# EAGLE design grapefruit-board (EAGLE 7.4.0)
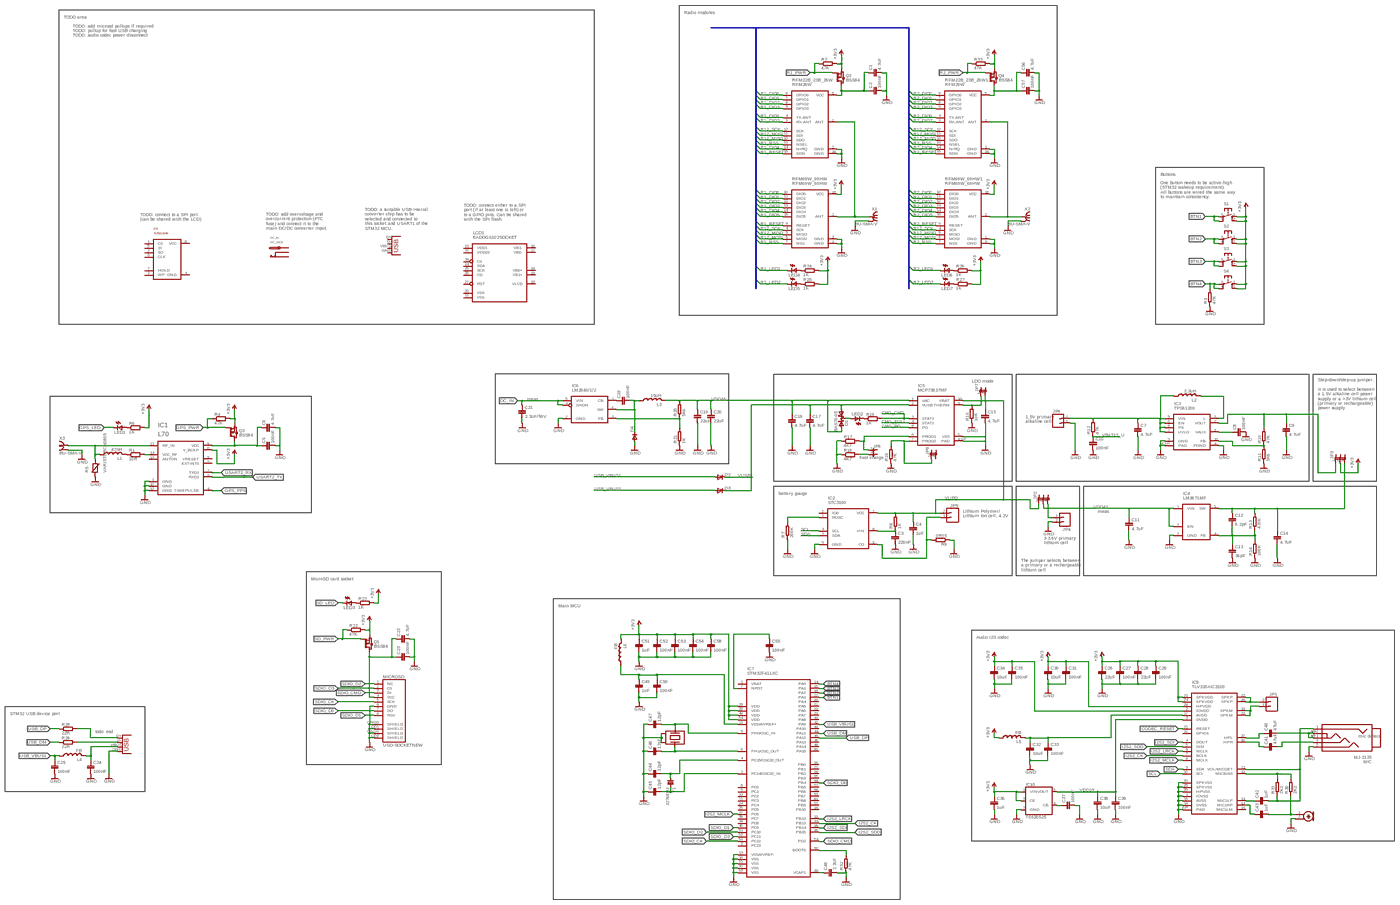
[diagram p0: schematic, sheet 1, overview]
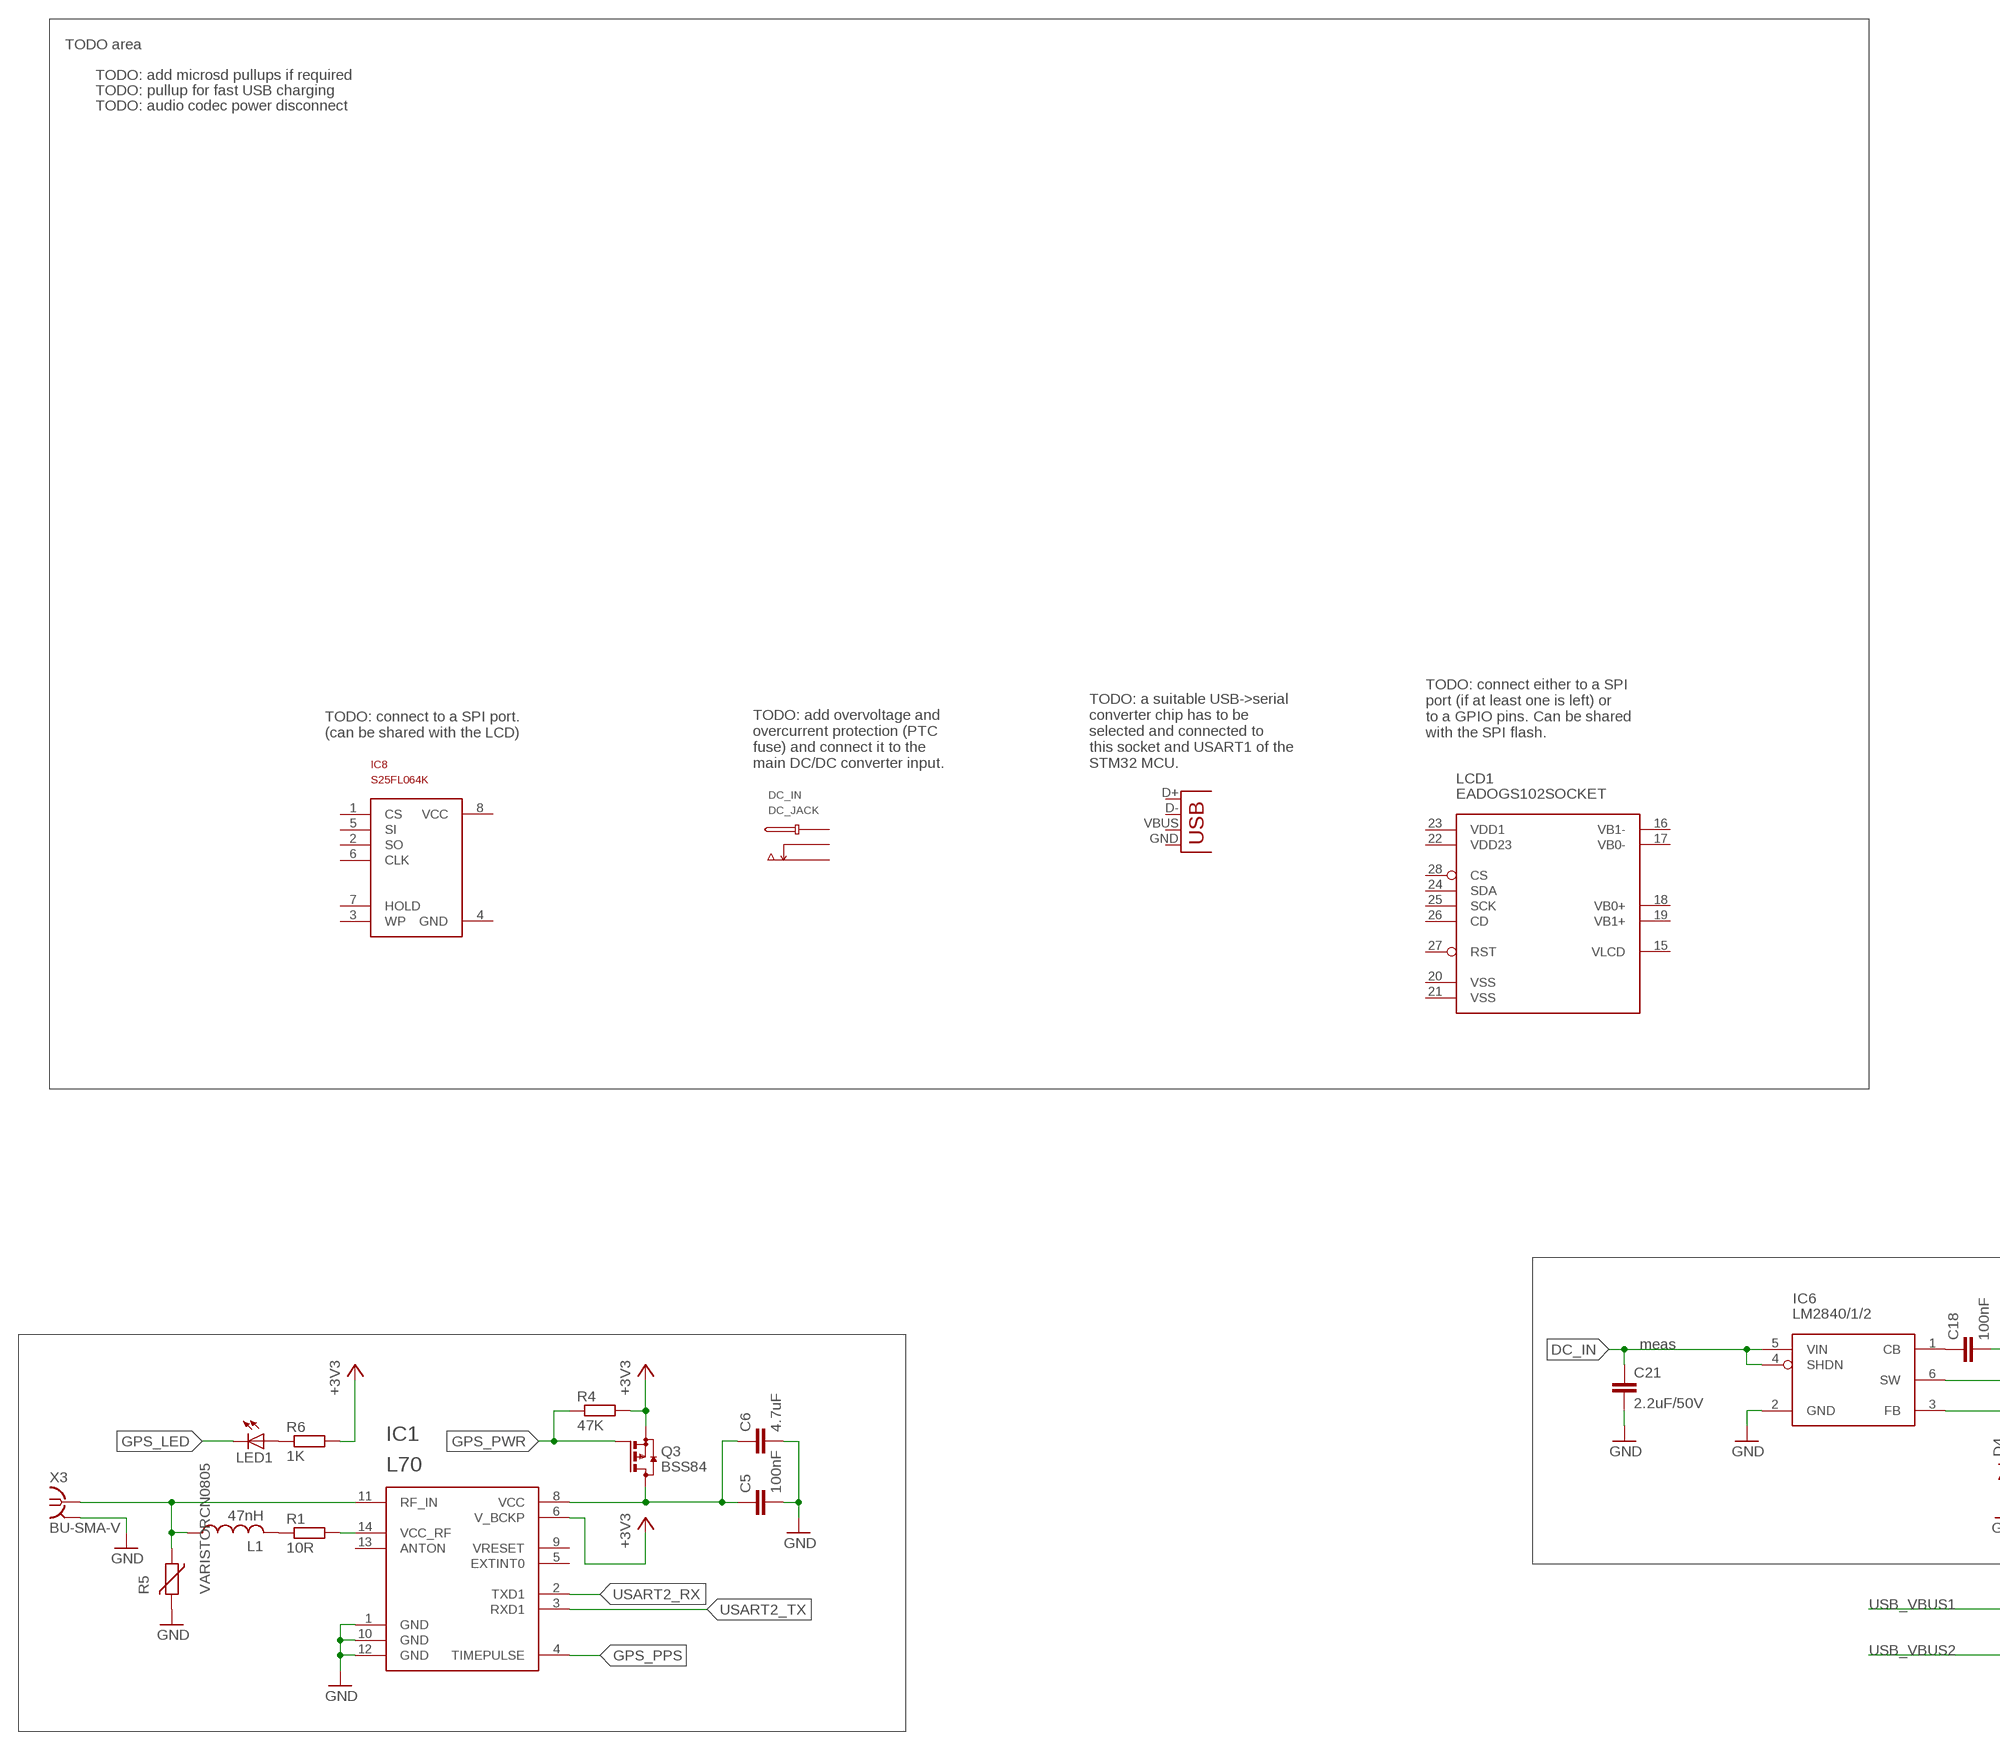
[diagram p1: schematic, sheet 1, part 1 of 4]
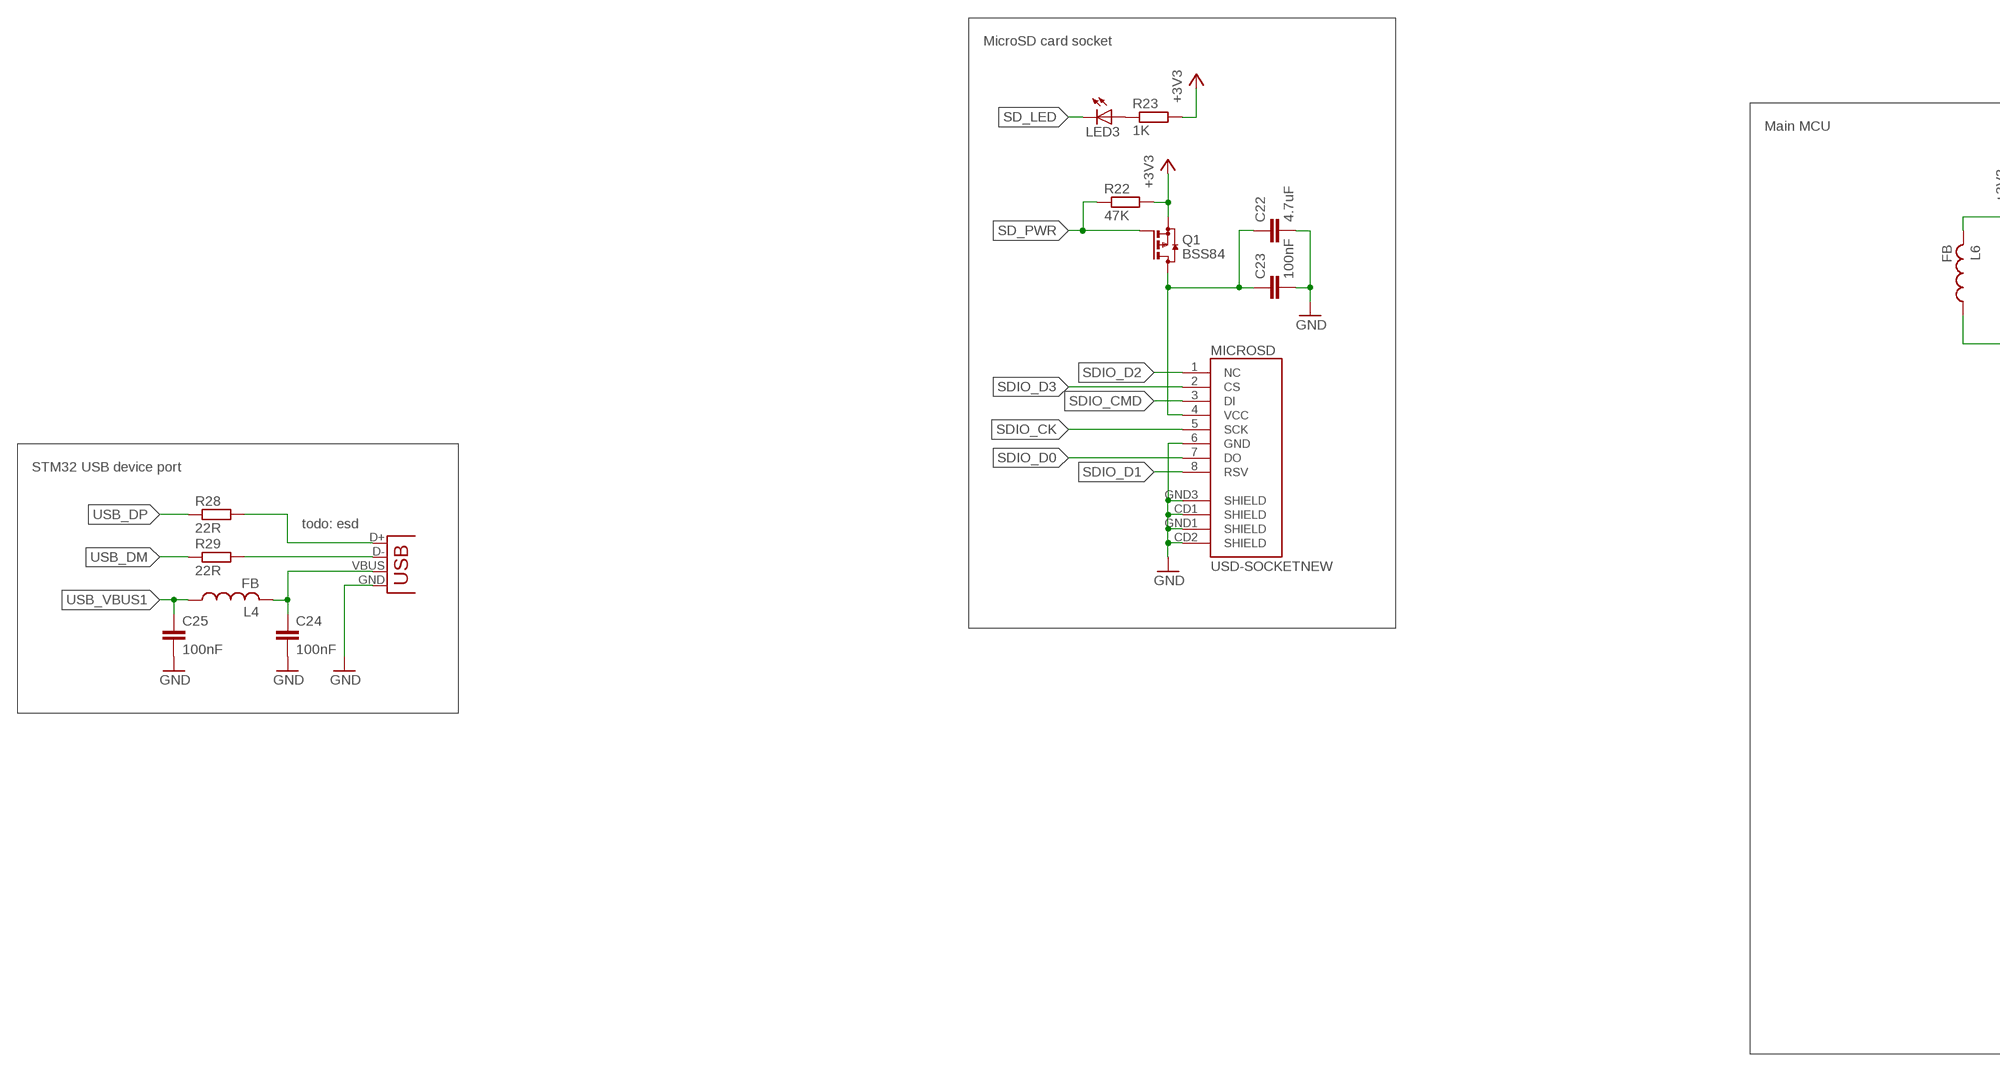
[diagram p2: schematic, sheet 1, part 2 of 4]
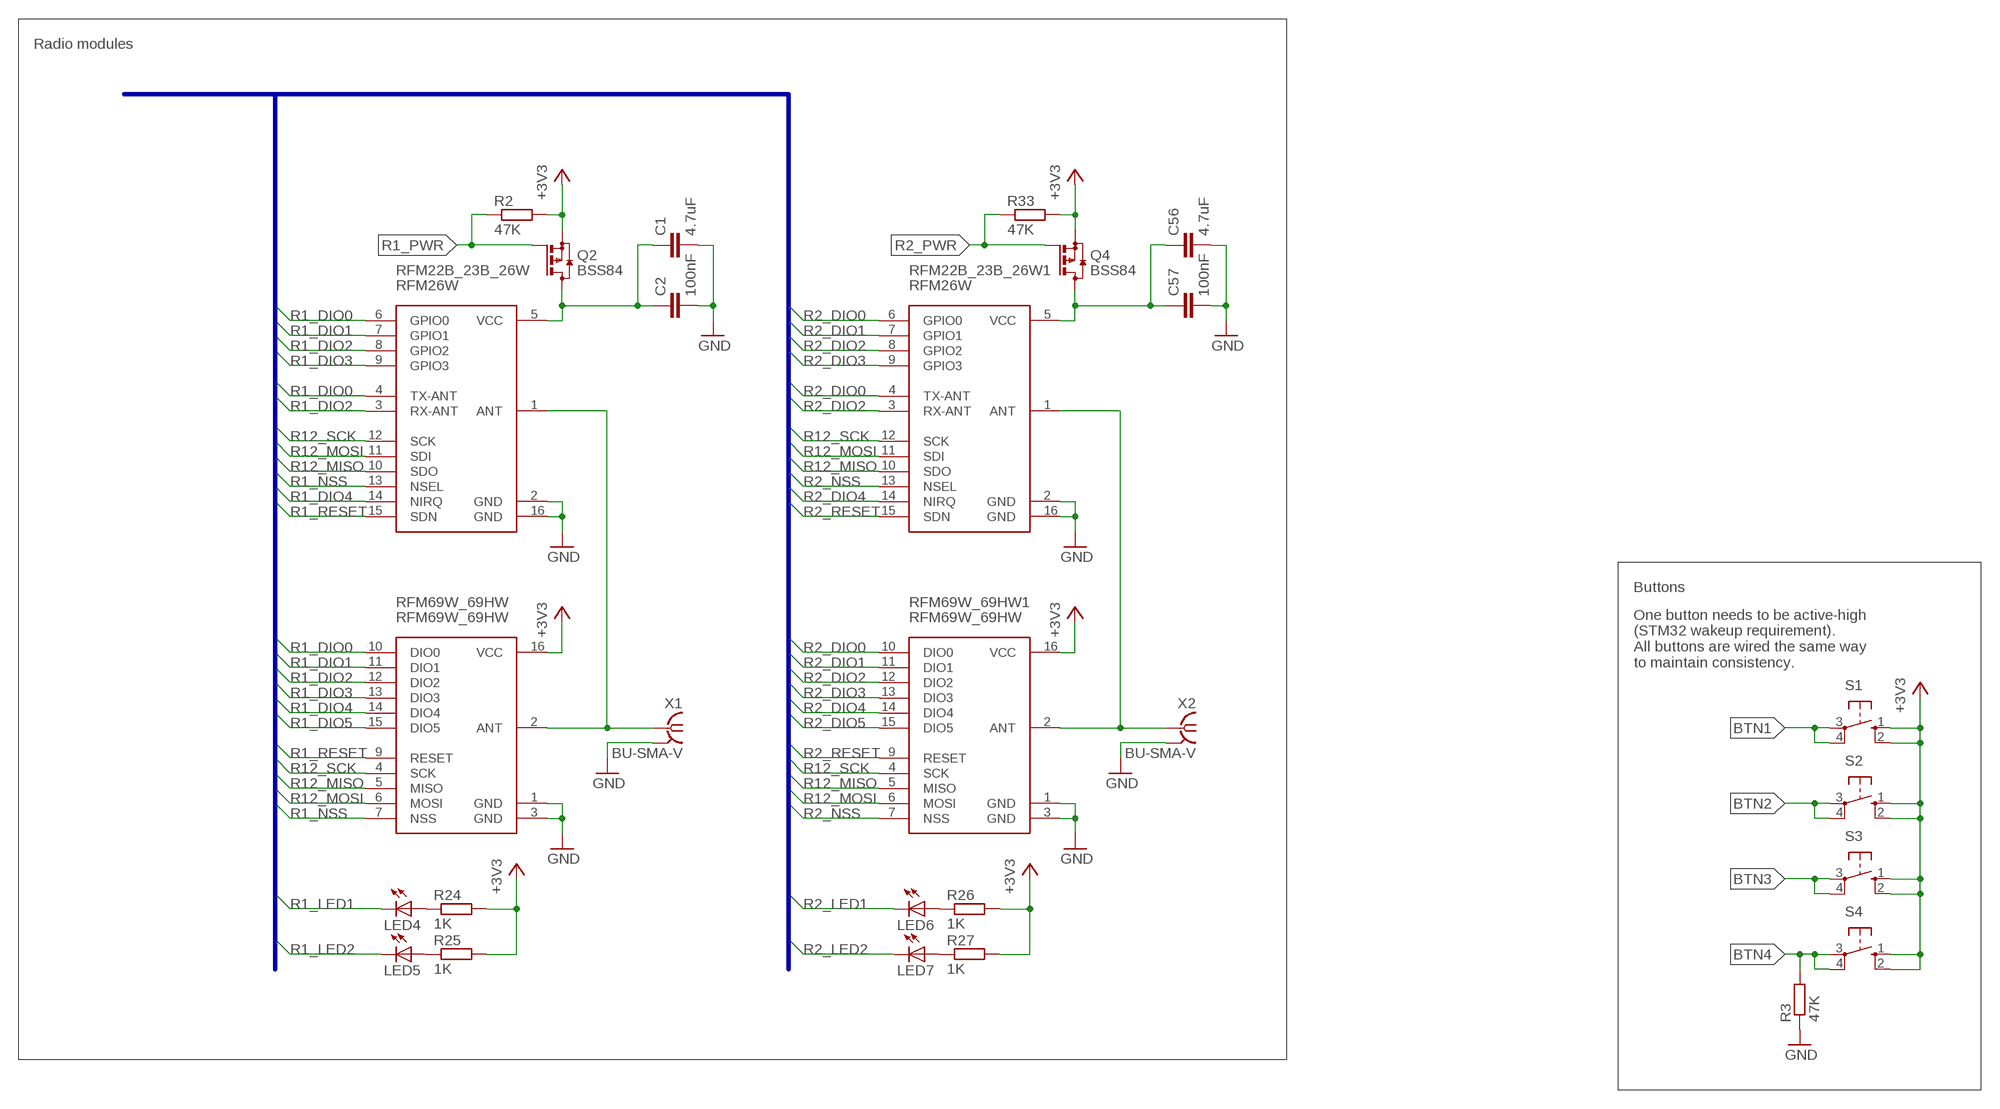
[diagram p3: schematic, sheet 1, part 3 of 4]
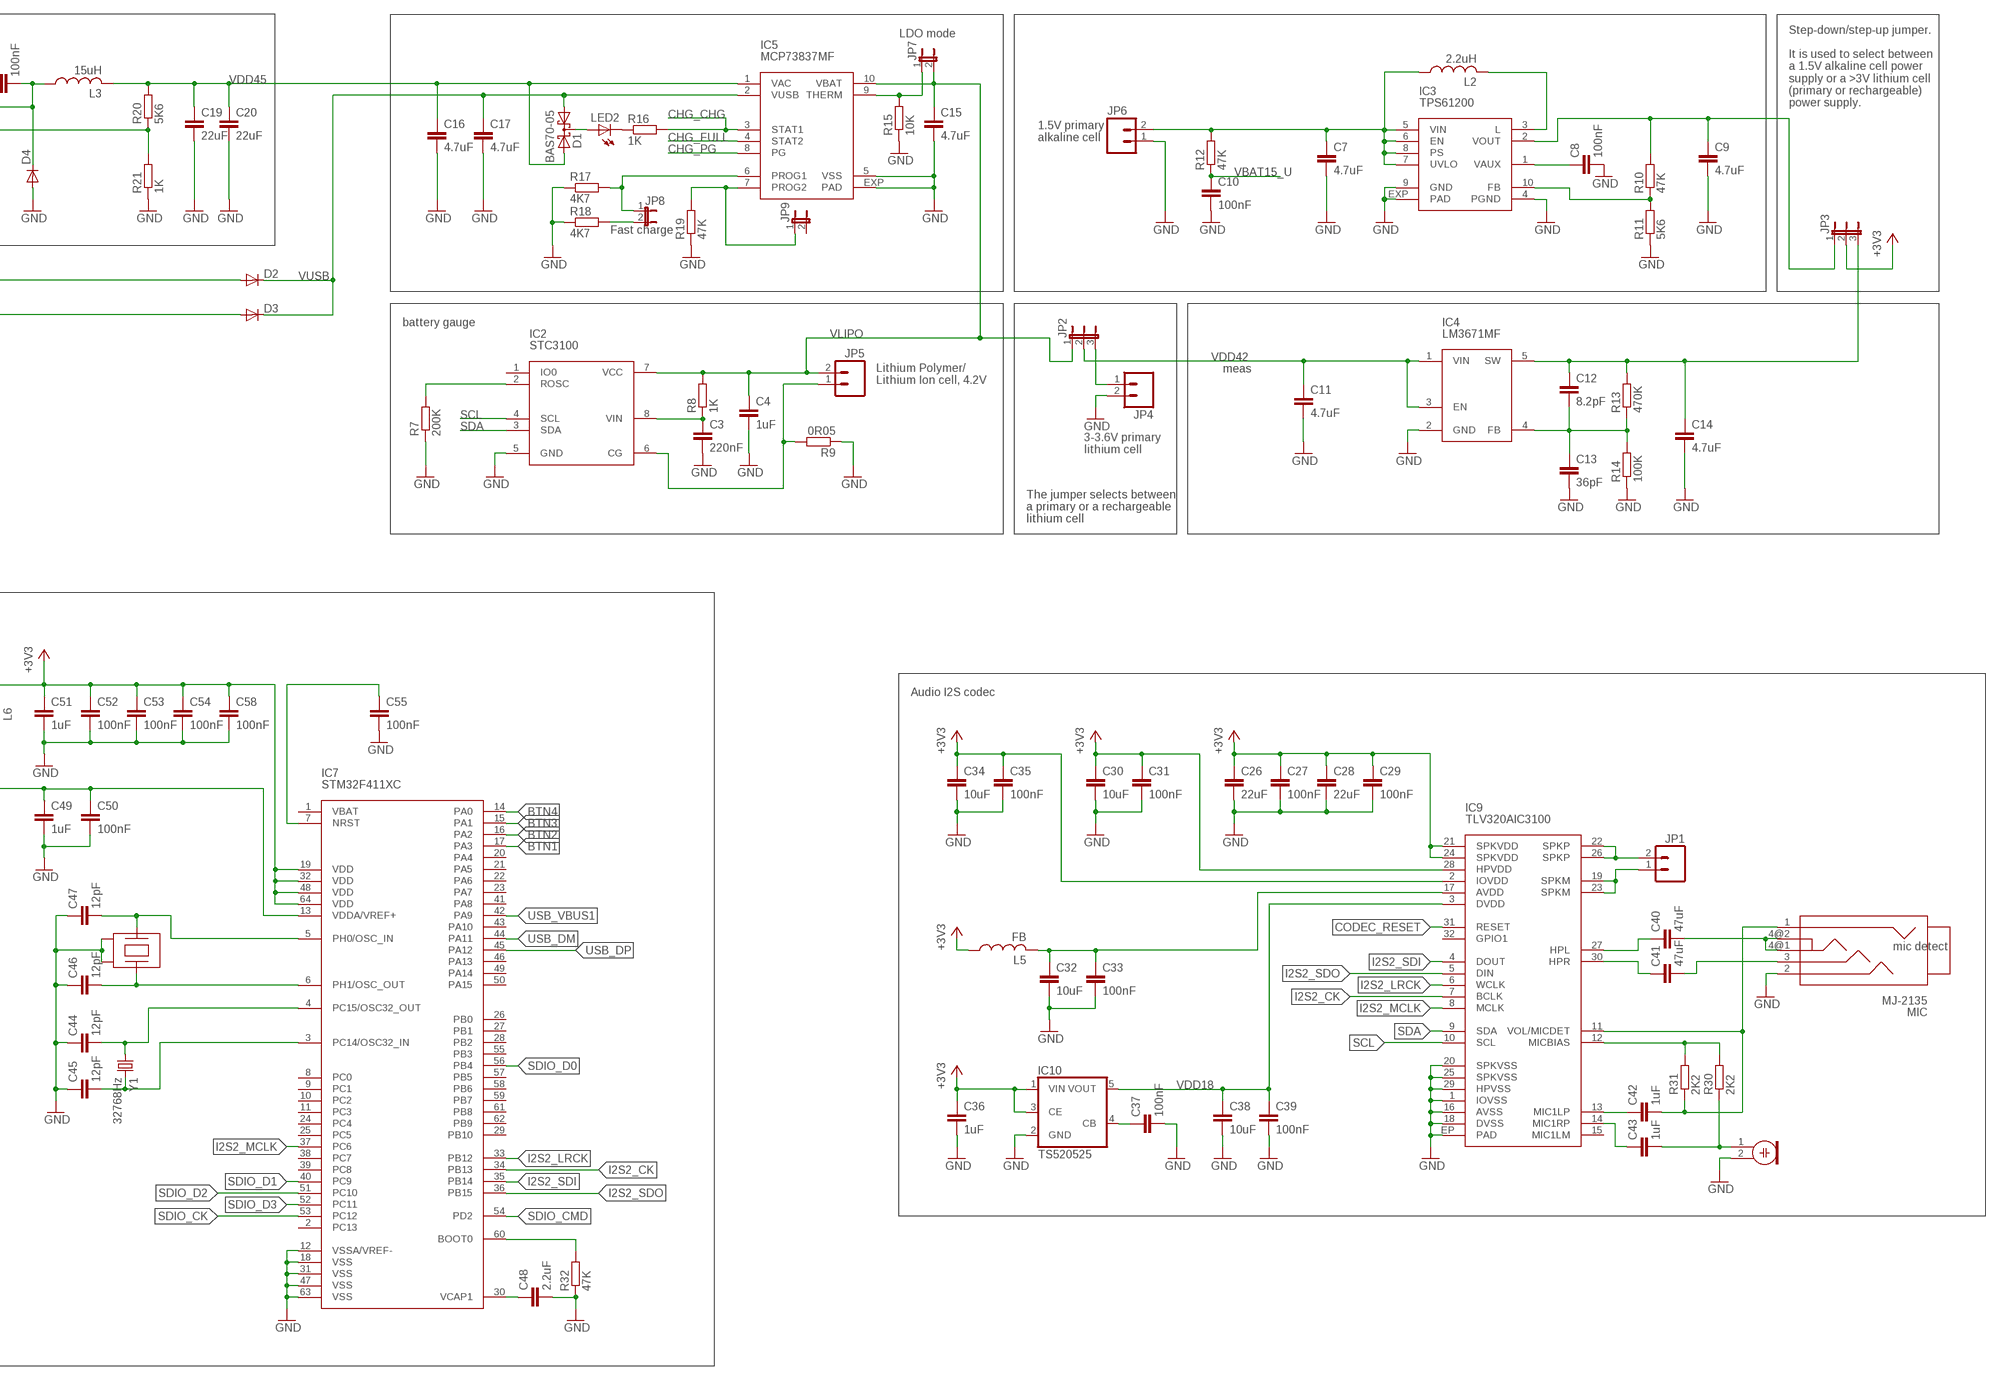
[diagram p4: schematic, sheet 1, part 4 of 4]

## Parts
C1  4.7uF  C-EUC0805  [C0805]
C2  100nF  C-EUC0603  [C0603]
C3  220nF  C-EUC0603  [C0603]
C4  1uF  C-EUC0603  [C0603]
C5  100nF  C-EUC0603  [C0603]
C6  4.7uF  C-EUC0805  [C0805]
C7  4.7uF  C-EUC0805  [C0805]
C8  100nF  C-EUC0603  [C0603]
C9  4.7uF  C-EUC0805  [C0805]
C10  100nF  C-EUC0603  [C0603]
C11  4.7uF  C-EUC0805  [C0805]
C12  8.2pF  C-EUC0603  [C0603]
C13  36pF  C-EUC0603  [C0603]
C14  4.7uF  C-EUC0805  [C0805]
C15  4.7uF  C-EUC0805  [C0805]
C16  4.7uF  C-EUC0805  [C0805]
C17  4.7uF  C-EUC0805  [C0805]
C18  100nF  C-EUC0603  [C0603]
C19  22uF  C-EUC1206  [C1206]
C20  22uF  C-EUC1206  [C1206]
C21  2.2uF/50V  C-EUC1206  [C1206]
C22  4.7uF  C-EUC0805  [C0805]
C23  100nF  C-EUC0603  [C0603]
C24  100nF  C-EUC0603  [C0603]
C25  100nF  C-EUC0603  [C0603]
C26  22uF  C-EUC1206  [C1206]
C27  100nF  C-EUC0603  [C0603]
C28  22uF  C-EUC1206  [C1206]
C29  100nF  C-EUC0603  [C0603]
C30  10uF  C-EUC1206  [C1206]
C31  100nF  C-EUC0603  [C0603]
C32  10uF  C-EUC1206  [C1206]
C33  100nF  C-EUC0603  [C0603]
C34  10uF  C-EUC1206  [C1206]
C35  100nF  C-EUC0603  [C0603]
C36  1uF  C-EUC0805  [C0805]
C37  100nF  C-EUC0603  [C0603]
C38  10uF  C-EUC1206  [C1206]
C39  100nF  C-EUC0603  [C0603]
C40  47uF  C-EUC1206  [C1206]
C41  47uF  C-EUC1206  [C1206]
C42  1uF  C-EUC0603  [C0603]
C43  1uF  C-EUC0603  [C0603]
C44  12pF  C-EUC0603  [C0603]
C45  12pF  C-EUC0603  [C0603]
C46  12pF  C-EUC0603  [C0603]
C47  12pF  C-EUC0603  [C0603]
C48  2.2uF  C-EUC0805  [C0805]
C49  1uF  C-EUC0603  [C0603]
C50  100nF  C-EUC0603  [C0603]
C51  1uF  C-EUC0603  [C0603]
C52  100nF  C-EUC0603  [C0603]
C53  100nF  C-EUC0603  [C0603]
C54  100nF  C-EUC0603  [C0603]
C55  100nF  C-EUC0603  [C0603]
C56  4.7uF  C-EUC0805  [C0805]
C57  100nF  C-EUC0603  [C0603]
C58  100nF  C-EUC0603  [C0603]
D1  BAS70-05  [SOT23]
D2  DIODE-MICROMELF-W  [MICROMELF-W]
D3  DIODE-MICROMELF-W  [MICROMELF-W]
D4  DIODE-MICROMELF-W  [MICROMELF-W]
DC_IN  DC_JACK  [DC_JACK]
IC1  L70  [L70]
IC2  STC3100  [MSOP8]
IC3  TPS61200  [DFN10-3X3]
IC4  LM3671MF  [SOT23-5]
IC5  MCP73837MF  [DFN10-3X3]
IC6  LM2840/1/2  [SOT23-6]
IC7  STM32F411XC  [LQFP64]
IC8  S25FL064K  [SO-08M]
IC9  TLV320AIC3100  [QFN32]
IC10  TS520525  [SOT25]
JP1  M02JST-PTH-2  [JST-2-PTH]
JP2  JP2E  [JP2]
JP3  JP2E  [JP2]
JP4  M02JST-PTH-2  [JST-2-PTH]
JP5  M02JST-PTH-2  [JST-2-PTH]
JP6  M02JST-PTH-2  [JST-2-PTH]
JP7  JP1E  [JP1]
JP8  JP1E  [JP1]
JP9  JP1E  [JP1]
L1  47nH  L-USL2012C  [L2012C]
L2  2.2uH  L-USL2012C  [L2012C]
L3  15uH  L-USL3225M  [L3225M]
L4  FB  L-USL2012C  [L2012C]
L5  FB  L-USL2012C  [L2012C]
L6  FB  L-USL2012C  [L2012C]
LCD1  EADOGS102SOCKET  [EADOGS-SOCKET]
LED1  LEDCHIP-LED0603  [CHIP-LED0603]
LED2  LEDCHIP-LED0603  [CHIP-LED0603]
LED3  LEDCHIP-LED0603  [CHIP-LED0603]
LED4  LEDCHIP-LED0603  [CHIP-LED0603]
LED5  LEDCHIP-LED0603  [CHIP-LED0603]
LED6  LEDCHIP-LED0603  [CHIP-LED0603]
LED7  LEDCHIP-LED0603  [CHIP-LED0603]
M1  ELECTRET_MICROPHON-WM-62PC/62PK  [WM-62PC/62PK]
MIC  MJ-2135  [JACK_35_4POLE]
MICROSD  USD-SOCKETNEW  [MICRO-SD-SOCKET-PP]
Q1  BSS84  [SOT23]
Q2  BSS84  [SOT23]
Q3  BSS84  [SOT23]
Q4  BSS84  [SOT23]
R1  10R  R-EU_R0603  [R0603]
R2  47K  R-EU_R0603  [R0603]
R3  47K  R-EU_R0603  [R0603]
R4  47K  R-EU_R0603  [R0603]
R5  VARISTORCN0805  [CT/CN0805]
R6  1K  R-EU_R0603  [R0603]
R7  200K  R-EU_R0603  [R0603]
R8  1K  R-EU_R0603  [R0603]
R9  0R05  R-EU_R0805  [R0805]
R10  47K  R-EU_R0603  [R0603]
R11  5K6  R-EU_R0603  [R0603]
R12  47K  R-EU_R0603  [R0603]
R13  470K  R-EU_R0603  [R0603]
R14  100K  R-EU_R0603  [R0603]
R15  10K  R-EU_R0603  [R0603]
R16  1K  R-EU_R0603  [R0603]
R17  4K7  R-EU_R0603  [R0603]
R18  4K7  R-EU_R0603  [R0603]
R19  47K  R-EU_R0603  [R0603]
R20  5K6  R-EU_R0603  [R0603]
R21  1K  R-EU_R0603  [R0603]
R22  47K  R-EU_R0603  [R0603]
R23  1K  R-EU_R0603  [R0603]
R24  1K  R-EU_R0603  [R0603]
R25  1K  R-EU_R0603  [R0603]
R26  1K  R-EU_R0603  [R0603]
R27  1K  R-EU_R0603  [R0603]
R28  22R  R-EU_R0603  [R0603]
R29  22R  R-EU_R0603  [R0603]
R30  2K2  R-EU_R0603  [R0603]
R31  2K2  R-EU_R0603  [R0603]
R32  47K  R-EU_R0603  [R0603]
R33  47K  R-EU_R0603  [R0603]
RFM22B_23B_26W  RFM26W  [MODULE_16X16_16PIN]
RFM22B_23B_26W1  RFM26W  [MODULE_16X16_16PIN]
RFM69W_69HW  RFM69W_69HW  [MODULE_20X12_16PIN]
RFM69W_69HW1  RFM69W_69HW  [MODULE_20X12_16PIN]
S1  10-XX  [B3F-10XX]
S2  10-XX  [B3F-10XX]
S3  10-XX  [B3F-10XX]
S4  10-XX  [B3F-10XX]
U$1  XTAL-7M  [XTAL_7M]
X1  BU-SMA-V  [BU-SMA-V]
X2  BU-SMA-V  [BU-SMA-V]
X3  BU-SMA-V  [BU-SMA-V]
X4  USB-MICROB  [USB-MICROB]
X5  USB-MICROB  [USB-MICROB]
Y1  32768Hz  CRYSTALTC26H  [TC26H]

## Nets
+3V3: C26.1 C27.1 C28.1 C29.1 C30.1 C31.1 C34.1 C35.1 C36.1 C51.1 C52.1 C53.1 C54.1 C58.1 IC1.6(V_BCKP) IC7.19(VDD) IC7.32(VDD) IC7.48(VDD) IC7.64(VDD) IC9.2(IOVDD) IC9.21(SPKVDD) IC9.24(SPKVDD) IC9.28(HPVDD) IC10.1(VIN) IC10.3(CE) JP3.2 L5.1 L6.2 Q1.2(S) Q2.2(S) Q3.2(S) Q4.2(S) R2.2 R4.2 R6.2 R22.2 R23.2 R24.2 R25.2 R26.2 R27.2 R33.2 RFM69W_69HW1.16(VCC) RFM69W_69HW.16(VCC) S1.1(S) S1.2(S1) S2.1(S) S2.2(S1) S3.1(S) S3.2(S1) S4.1(S) S4.2(S1)
BTN1: IC7.17(PA3) S1.3(P) S1.4(P1)
BTN2: IC7.16(PA2) S2.3(P) S2.4(P1)
BTN3: IC7.15(PA1) S3.3(P) S3.4(P1)
BTN4: IC7.14(PA0) R3.2 S4.3(P) S4.4(P1)
CHG_CHG: IC5.3(STAT1) R16.2
CHG_FULL: IC5.4(STAT2)
CHG_PG: IC5.8(PG)
CODEC_RESET: IC9.31(RESET)
DC_IN: C21.1 IC6.4(SHDN) IC6.5(VIN)
GND: C1.2 C2.2 C3.2 C4.2 C5.2 C6.2 C7.2 C8.2 C9.2 C10.2 C11.2 C13.2 C14.2 C15.2 C16.2 C17.2 C19.2 C20.2 C21.2 C22.2 C23.2 C24.2 C25.2 C26.2 C27.2 C28.2 C29.2 C30.2 C31.2 C32.2 C33.2 C34.2 C35.2 C36.2 C37.2 C38.2 C39.2 C44.1 C45.1 C46.1 C47.1 C48.2 C49.2 C50.2 C51.2 C52.2 C53.2 C54.2 C55.2 C56.2 C57.2 C58.2 D4.A IC1.1(GND) IC1.10(GND) IC1.12(GND) IC2.5(GND) IC3.4(PGND) IC3.9(GND) IC3.EXP(PAD) IC4.2(GND) IC5.5(VSS) IC5.EXP(PAD) IC6.2(GND) IC7.12(VSSA/VREF-) IC7.18(VSS) IC7.31(VSS) IC7.47(VSS) IC7.63(VSS) IC9.1(IOVSS) IC9.16(AVSS) IC9.18(DVSS) IC9.20(SPKVSS) IC9.25(SPKVSS) IC9.29(HPVSS) IC9.EP(PAD) IC10.2(GND) JP4.2 JP6.1 M1.2 MIC.2 MICROSD.6(GND) MICROSD.CD1(SHIELD) MICROSD.CD2(SHIELD) MICROSD.GND1(SHIELD) MICROSD.GND3(SHIELD) R3.1 R5.2 R7.1 R9.1 R11.1 R14.1 R15.1 R17.1 R18.1 R19.1 R21.1 R32.1 RFM22B_23B_26W1.2(GND) RFM22B_23B_26W1.16(GND) RFM22B_23B_26W.2(GND) RFM22B_23B_26W.16(GND) RFM69W_69HW1.1(GND) RFM69W_69HW1.3(GND) RFM69W_69HW.1(GND) RFM69W_69HW.3(GND) U$1.2(G1) U$1.4(G2) X1.2 X1.3 X1.4 X1.5 X2.2 X2.3 X2.4 X2.5 X3.2 X3.3 X3.4 X3.5 X4.GND
GPS_LED: LED1.C
GPS_PPS: IC1.4(TIMEPULSE)
GPS_PWR: Q3.1(G) R4.1
I2S2_CK: IC7.34(PB13) IC9.7(BCLK)
I2S2_LRCK: IC7.33(PB12) IC9.6(WCLK)
I2S2_MCLK: IC7.37(PC6) IC9.8(MCLK)
I2S2_SDI: IC7.35(PB14) IC9.4(DOUT)
I2S2_SDO: IC7.36(PB15) IC9.5(DIN)
N$1: RFM22B_23B_26W1.1(ANT) RFM69W_69HW1.2(ANT) X2.1
N$2: RFM22B_23B_26W.1(ANT) RFM69W_69HW.2(ANT) X1.1
N$3: L1.2 R1.1
N$4: IC1.11(RF_IN) L1.1 R5.1 X3.1
N$5: IC1.14(VCC_RF) R1.2
N$6: C1.1 C2.1 Q2.3(D) RFM22B_23B_26W.5(VCC)
N$7: LED1.A R6.1
N$8: C5.1 C6.1 IC1.8(VCC) Q3.3(D)
N$9: C7.1 IC3.5(VIN) IC3.6(EN) IC3.7(UVLO) IC3.8(PS) JP6.2 L2.1 R12.2
N$10: JP2.3 JP4.1
N$11: IC2.6(CG) JP5.1 R9.2
N$12: IC5.9(THERM) JP7.1 R15.2
N$13: IC5.6(PROG1) JP8.1 R17.2
N$14: C12.1 C14.1 IC4.5(SW) JP3.3 R13.2
N$15: C3.1 IC2.8(VIN) R8.1
N$16: C8.1 IC3.1(VAUX)
N$17: IC2.2(ROSC) R7.2
N$18: C9.1 IC3.2(VOUT) JP3.1 R10.2
N$19: IC3.3(L) L2.2
N$20: C12.2 C13.1 IC4.4(FB) R13.1 R14.2
N$21: IC3.10(FB) R10.1 R11.2
N$22: JP8.2 R18.2
N$23: LED2.C R16.1
N$24: D1.3(C) LED2.A
N$25: IC5.7(PROG2) JP9.1 R19.2
N$26: C18.1 IC6.1(CB)
N$27: C18.2 D4.C IC6.6(SW) L3.1
N$28: IC6.3(FB) R20.1 R21.2
N$29: C22.1 C23.1 MICROSD.4(VCC) Q1.3(D)
N$30: LED3.A R23.1
N$31: LED4.A R24.1
N$32: LED5.A R25.1
N$33: LED6.A R26.1
N$34: LED7.A R27.1
N$35: R28.2 X4.D+
N$36: R29.2 X4.D-
N$37: C24.1 L4.2 X4.VBUS
N$38: C43.1 IC9.14(MIC1RP)
N$39: C32.1 C33.1 IC9.17(AVDD) L5.2
N$40: C37.1 IC10.4(CB)
N$41: C40.2 MIC.4@1 MIC.4@2
N$42: C41.2 MIC.3
N$43: C41.1 IC9.30(HPR)
N$44: C40.1 IC9.27(HPL)
N$45: C44.2 IC7.4(PC15/OSC32_OUT) Y1.1
N$46: C42.1 IC9.13(MIC1LP)
N$47: C42.2 IC9.11(VOL/MICDET) MIC.1 R31.1
N$48: C43.2 M1.1 R30.1
N$49: IC9.12(MICBIAS) R30.2 R31.2
N$50: IC9.22(SPKP) IC9.26(SPKP) JP1.2
N$51: IC9.19(SPKM) IC9.23(SPKM) JP1.1
N$52: C45.2 IC7.3(PC14/OSC32_IN) Y1.2
N$53: C55.1 IC7.7(NRST)
N$54: C47.2 IC7.5(PH0/OSC_IN) U$1.1
N$55: C46.2 IC7.6(PH1/OSC_OUT) U$1.3
N$56: C56.1 C57.1 Q4.3(D) RFM22B_23B_26W1.5(VCC)
N$57: IC7.60(BOOT0) R32.2
N$58: C48.1 IC7.30(VCAP1)
N$59: C49.1 C50.1 IC7.13(VDDA/VREF+) L6.1
R1_DIO0: RFM22B_23B_26W.4(TX-ANT) RFM22B_23B_26W.6(GPIO0) RFM69W_69HW.10(DIO0)
R1_DIO1: RFM22B_23B_26W.7(GPIO1) RFM69W_69HW.11(DIO1)
R1_DIO2: RFM22B_23B_26W.3(RX-ANT) RFM22B_23B_26W.8(GPIO2) RFM69W_69HW.12(DIO2)
R1_DIO3: RFM22B_23B_26W.9(GPIO3) RFM69W_69HW.13(DIO3)
R1_DIO4: RFM22B_23B_26W.14(NIRQ) RFM69W_69HW.14(DIO4)
R1_DIO5: RFM69W_69HW.15(DIO5)
R1_LED1: LED4.C
R1_LED2: LED5.C
R1_NSS: RFM22B_23B_26W.13(NSEL) RFM69W_69HW.7(NSS)
R1_PWR: Q2.1(G) R2.1
R1_RESET: RFM22B_23B_26W.15(SDN) RFM69W_69HW.9(RESET)
R2_DIO0: RFM22B_23B_26W1.4(TX-ANT) RFM22B_23B_26W1.6(GPIO0) RFM69W_69HW1.10(DIO0)
R2_DIO1: RFM22B_23B_26W1.7(GPIO1) RFM69W_69HW1.11(DIO1)
R2_DIO2: RFM22B_23B_26W1.3(RX-ANT) RFM22B_23B_26W1.8(GPIO2) RFM69W_69HW1.12(DIO2)
R2_DIO3: RFM22B_23B_26W1.9(GPIO3) RFM69W_69HW1.13(DIO3)
R2_DIO4: RFM22B_23B_26W1.14(NIRQ) RFM69W_69HW1.14(DIO4)
R2_DIO5: RFM69W_69HW1.15(DIO5)
R2_LED1: LED6.C
R2_LED2: LED7.C
R2_NSS: RFM22B_23B_26W1.13(NSEL) RFM69W_69HW1.7(NSS)
R2_PWR: Q4.1(G) R33.1
R2_RESET: RFM22B_23B_26W1.15(SDN) RFM69W_69HW1.9(RESET)
R12_MISO: RFM22B_23B_26W1.10(SDO) RFM22B_23B_26W.10(SDO) RFM69W_69HW1.5(MISO) RFM69W_69HW.5(MISO)
R12_MOSI: RFM22B_23B_26W1.11(SDI) RFM22B_23B_26W.11(SDI) RFM69W_69HW1.6(MOSI) RFM69W_69HW.6(MOSI)
R12_SCK: RFM22B_23B_26W1.12(SCK) RFM22B_23B_26W.12(SCK) RFM69W_69HW1.4(SCK) RFM69W_69HW.4(SCK)
SCL: IC2.4(SCL) IC9.10(SCL)
SD_LED: LED3.C
SD_PWR: Q1.1(G) R22.1
SDA: IC2.3(SDA) IC9.9(SDA)
SDIO_CK: IC7.53(PC12) MICROSD.5(SCK)
SDIO_CMD: IC7.54(PD2) MICROSD.3(DI)
SDIO_D0: IC7.56(PB4) MICROSD.7(DO)
SDIO_D1: IC7.40(PC9) MICROSD.8(RSV)
SDIO_D2: IC7.51(PC10) MICROSD.1(NC)
SDIO_D3: IC7.52(PC11) MICROSD.2(CS)
USART2_RX: IC1.2(TXD1)
USART2_TX: IC1.3(RXD1)
USB_DM: IC7.44(PA11) R29.1
USB_DP: IC7.45(PA12) R28.1
USB_VBUS1: C25.1 D2.A IC7.42(PA9) L4.1
USB_VBUS2: D3.A
VBAT15_U: C10.1 R12.1
VDD18: C38.1 C39.1 IC9.3(DVDD) IC10.5(VOUT)
VDD42: C11.1 IC4.1(VIN) IC4.3(EN) JP2.2
VDD45: C16.1 C19.1 C20.1 D1.2(A2) IC5.1(VAC) L3.2 R20.2
VLIPO: C4.1 C15.1 IC2.7(VCC) IC5.10(VBAT) JP2.1 JP5.2 JP7.2 R8.2
VUSB: C17.1 D1.1(A1) D2.C D3.C IC5.2(VUSB)
Unconnected: DC_IN.C DC_IN.O DC_IN.OSW IC1.5(EXTINT0) IC1.9(VRESET) IC1.13(ANTON) IC2.1(IO0) IC7.1(VBAT) IC7.2(PC13) IC7.8(PC0) IC7.9(PC1) IC7.10(PC2) IC7.11(PC3) IC7.20(PA4) IC7.21(PA5) IC7.22(PA6) IC7.23(PA7) IC7.24(PC4) IC7.25(PC5) IC7.26(PB0) IC7.27(PB1) IC7.28(PB2) IC7.29(PB10) IC7.38(PC7) IC7.39(PC8) IC7.41(PA8) IC7.43(PA10) IC7.46(PA13) IC7.49(PA14) IC7.50(PA15) IC7.55(PB3) IC7.57(PB5) IC7.58(PB6) IC7.59(PB7) IC7.61(PB8) IC7.62(PB9) IC8.1(CS) IC8.2(SO) IC8.3(WP) IC8.5(SI) IC8.6(CLK) IC8.7(HOLD) IC9.15(MIC1LM) IC9.32(GPIO1) JP9.2 LCD1.15(VLCD) LCD1.16(VB1-) LCD1.17(VB0-) LCD1.18(VB0+) LCD1.19(VB1+) LCD1.20(VSS) LCD1.21(VSS) LCD1.22(VDD23) LCD1.23(VDD1) LCD1.24(SDA) LCD1.25(SCK) LCD1.26(CD) LCD1.27(RST) LCD1.28(CS) X5.D+ X5.D- X5.GND X5.VBUS

## Buses
R1_DIO[0..5],R2_DIO[0..5],R1_RESET,R2_RESET,R12_SCK,R12_MISO,R12_MOSI,R1_NSS,R2_NSS,R1_LED1,R1_LED2,R2_LED1,R2_LED2

## Notes on the sheet
- Radio modules
- TODO area
- TODO: add microsd pullups if required
- TODO: pullup for fast USB charging
- TODO: audio codec power disconnect
- Buttons
- One button needs to be active-high
  (STM32 wakeup requirement).
  All buttons are wired the same way
  to maintain consistency.
- TODO: connect to a SPI port.
  (can be shared with the LCD)
- TODO: connect either to a SPI
  port (if at least one is left) or
  to a GPIO pins. Can be shared
  with the SPI flash.
- TODO: add overvoltage and
  overcurrent protection (PTC
  fuse) and connect it to the
  main DC/DC converter input.
- TODO: a suitable USB->serial
  converter chip has to be
  selected and connected to
  this socket and USART1 of the
  STM32 MCU.
- LDO mode
- meas
- Step-down/step-up jumper.
  
  It is used to select between
  a 1.5V alkaline cell power
  supply or a >3V lithium cell
  (primary or rechargeable)
  power supply.
- 1.5V primary
  alkaline cell
- Fast charge
- battery gauge
- meas
- Lithium Polymer/
  Lithium Ion cell, 4.2V
- 3-3.6V primary
  lithium cell
- The jumper selects between
  a primary or a rechargeable
  lithium cell
- MicroSD card socket
- Main MCU
- Audio I2S codec
- STM32 USB device port
- todo: esd
- mic detect

## Power pins joined to a net without a drawn wire
GND: IC8.4(GND)
VCC: IC8.8(VCC)

## Library data of the parts
C1-C58 = rcl:C-EU: CAPACITOR, European symbol
D1 = diode:BAS70-05: Silicon Schottky Diodes General-purpose diode for high-speed switching
D2-D4 = diode:DIODE-: DIODE
DC_IN = con-qyx:DC_JACK
IC1 = qyx-misc:L70
IC2 = stc3100:STC3100
IC3 = qyx-misc:TPS61200
IC4 = qyx-misc:LM3671
IC5 = chargers:MCP73837
IC6 = dc-dc-regulators:LM2840/1/2
IC7 = stm32f411:STM32F411XC
IC8 = qyx-misc:S25FL064K
IC9 = audio-codec:TLV320AIC3100
IC10 = v-reg:TS5205: 150mA Low Noise LDO Voltage Regulator with Enable TSC [Taiwan Semiconductor Company, Ltd] Source: http://www.taiwansemi.com .. 5205_0409c.pdf
JP1 JP4-JP6 = SparkFun:M02: Header 2 Standard 2-pin 0.1" header. Use with straight break away headers (SKU : PRT-00116), right angle break away headers (PRT-00553), swiss pins (PRT-00743), machine pins (PRT-00117), and female headers (PRT-00115). Molex polarized connector foot print use with SKU : PRT-08233 with associated crimp pins and housings.
JP2 JP3 = jumper:JP2E: JUMPER
JP7-JP9 = jumper:JP1E: JUMPER
L1-L6 = rcl:L-US: INDUCTOR, American symbol
LCD1 = eadog:EADOGS102
LED1-LED7 = led:LED: LED OSRAM: - CHIPLED LG R971, LG N971, LY N971, LG Q971, LY Q971, LO R971, LY R971 LH N974, LH R974 LS Q976, LO Q976, LY Q976 LO Q996 - Hyper CHIPLED LW Q18S LB Q993, LB Q99A, LB R99A - SideLED LS A670, LO A670, LY A670, LG A670, LP A670 LB A673, LV A673, LT A673, LW A673 LH A674 LY A675 LS A676, LA A676, LO A676, LY A676, LW A676 LS A679, LY A679, LG A679 - Hyper Micro SIDELED® LS Y876, LA Y876, LO Y876, LY Y876 LT Y87S - SmartLED LW L88C, LW L88S LB L89C, LB L89S, LG L890 LS L89K, LO L89K, LY L89K LS L896, LA L896, LO L896, LY L896 - TOPLED LS T670, LO T670, LY T670, LG T670, LP T670 LSG T670, LSP T670, LSY T670, LOP T670, LYG T670 LG T671, LOG T671, LSG T671 LB T673, LV T673, LT T673, LW T673 LH T674 LS T676, LA T676, LO T676, LY T676, LB T676, LH T676, LSB T676, LW T676 LB T67C, LV T67C, LT T67C, LS T67K, LO T67K, LY T67K, LW E67C LS E67B, LA E67B, LO E67B, LY E67B, LB E67C, LV E67C, LT E67C LW T67C LS T679, LY T679, LG T679 LS T770, LO T770, LY T770, LG T770, LP T770 LB T773, LV T773, LT T773, LW T773 LH T774 LS E675, LA E675, LY E675, LS T675 LS T776, LA T776, LO T776, LY T776, LB T776 LHGB T686 LT T68C, LB T68C - Hyper Mini TOPLED® LB M676 - Mini TOPLED Santana® LG M470 LS M47K, LO M47K, LY M47K Source: http://www.osram.convergy.de LUXEON: - LUMILED® LXK2-PW12-R00, LXK2-PW12-S00, LXK2-PW14-U00, LXK2-PW14-V00 LXK2-PM12-R00, LXK2-PM12-S00, LXK2-PM14-U00 LXK2-PE12-Q00, LXK2-PE12-R00, LXK2-PE12-S00, LXK2-PE14-T00, LXK2-PE14-U00 LXK2-PB12-K00, LXK2-PB12-L00, LXK2-PB12-M00, LXK2-PB14-N00, LXK2-PB14-P00, LXK2-PB14-Q00 LXK2-PR12-L00, LXK2-PR12-M00, LXK2-PR14-Q00, LXK2-PR14-R00 LXK2-PD12-Q00, LXK2-PD12-R00, LXK2-PD12-S00 LXK2-PH12-R00, LXK2-PH12-S00 LXK2-PL12-P00, LXK2-PL12-Q00, LXK2-PL12-R00 Source: www.luxeon.com KINGBRIGHT: KA-3528ASYC Source: www.kingbright.com
M1 = microphon:ELECTRET_MICROPHON-: Electret Condenser Microphone; PN: PMOF-6027PN-42UQ
MIC = qyx-misc:MJ-2135
MICROSD = SparkFun:USD-SOCKET: microSD Socket Push-push type uSD socket. Schematic element and footprint production proven. Spark Fun Electronics SKU : PRT-00127. tDoc lines correctly indicate media card edge positions when inserting (unlocked, locked, depressed).
Q1-Q4 = transistor-small-signal:BSS84: P-CHANNEL MOS FET
R1-R4 R6-R33 = rcl:R-EU_: RESISTOR, European symbol
R5 = varistor:VARISTOR: VARISTOR
RFM22B_23B_26W RFM22B_23B_26W1 = hoperf:RFM26W
RFM69W_69HW RFM69W_69HW1 = hoperf:RFM69W_69HW
S1-S4 = switch-omron:10-XX: OMRON SWITCH; MPN: B3F-1000; OC_FARNELL: 176432; OC_NEWARK: 36M3542
U$1 = qyx-misc:XTAL-7M
X1-X3 = con-coax:BU-SMA-V: FEMALE SMA CONNECTOR Radiall distributor RS 112-3794; OC_FARNELL: unknown; OC_NEWARK: unknown
X4 X5 = SparkFun:USB: USB Connectors USB-B-PTH is fully proven SKU : PRT-00139 USB-miniB is fully proven SKU : PRT-00587 USB-A-PCB is untested. USB-A-H is throughly reviewed, but untested. Spark Fun Electronics SKU : PRT-00437 USB-B-SMT is throughly reviewed, but untested. Needs silkscreen touching up. USB-A-S has not been used/tested USB-MB-H has not been used/tested
Y1 = SparkFun:CRYSTAL: Crystals Various standard crystals. Proven footprints. Spark Fun Electronics SKU : COM-00534

## Board
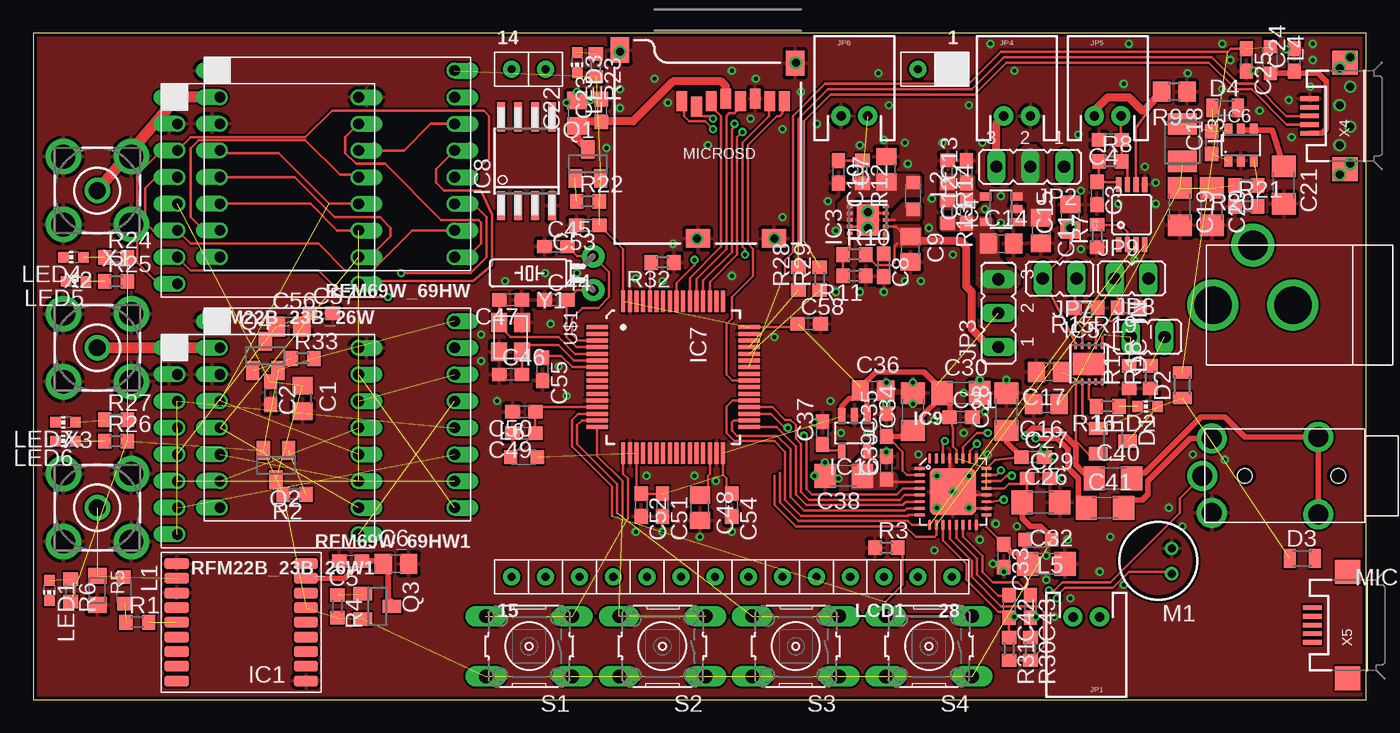
[diagram p5: board, top side]
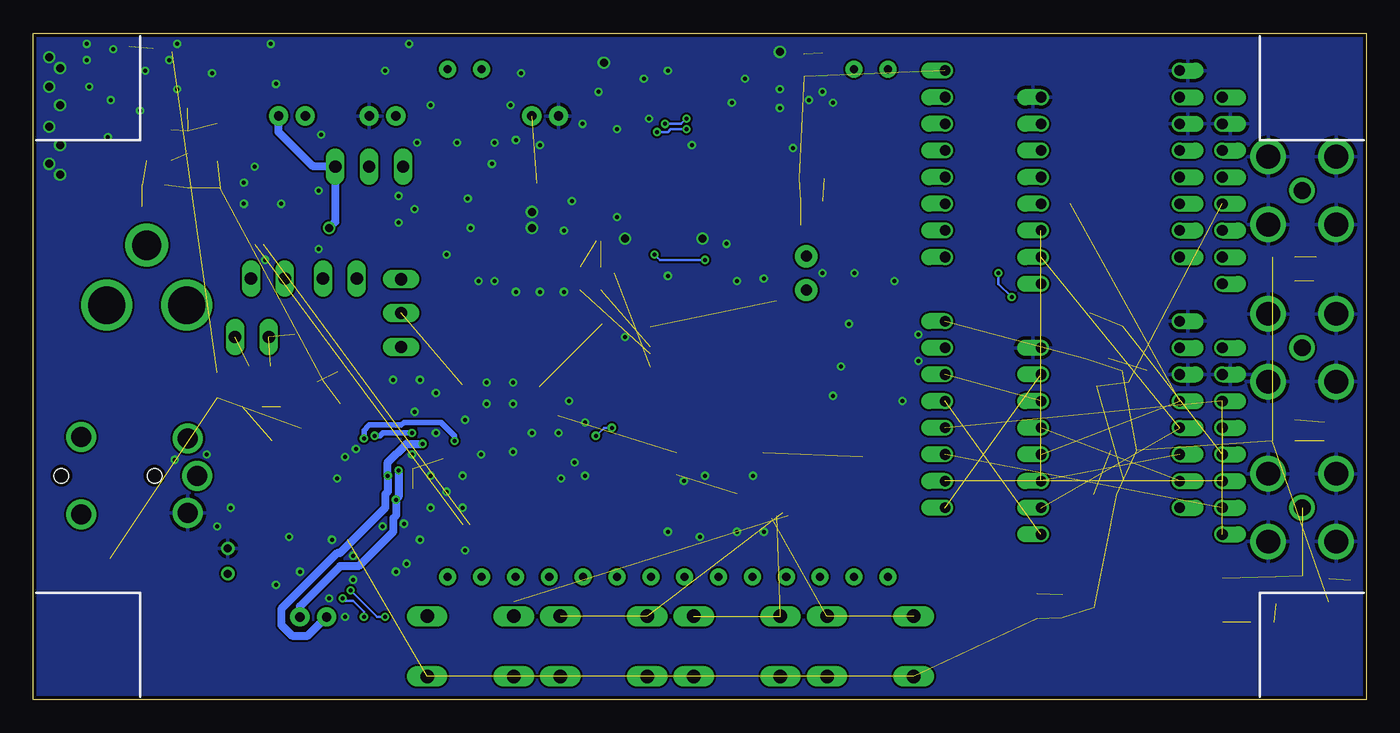
[diagram p6: board, bottom side, seen from below]

Size 100 x 50 mm. Coordinates in mm from the lower left corner, seen from the top.
Outline: 0,0 100,0 100,50 0,50 0,0
Copper layers (1*16): Top 0.035mm / dielectric 1.5mm / Bottom 0.035mm
Design rules "seeed": minimum track width 6mil, minimum drill 0.3mm, track to track 6mil, track to pad 6mil, pad to pad 6mil, via to via 6mil, smd to smd 0mil, copper to edge 10mil, drill to drill 10mil, minimum pad ring 6mil, minimum via ring 6mil, stop-mask expansion 2mil, vias tented up to drill 0.5mm, thermal gap 10mil

### Footprints (pad centres in the part's own frame; a part is rotated, then mirrored left to right if it is on the bottom)
C0805 = smd 1.3 x 1.5: 1 -0.95,0; 2 0.95,0
C0603 = smd 1.1 x 1: 1 -0.85,0; 2 0.85,0
C1206 = smd 1.6 x 1.8: 1 -1.4,0; 2 1.4,0
SOT23 = smd 1 x 1.4: 1 -0.95,-1.1; 2 0.95,-1.1; 3 0,1.1
MICROMELF-W = smd 0.9 x 1.4: A 0.95,0; C -0.95,0
DC_JACK = drill 2.8: C 0,6.5; O 0,0.5 | drill 2.2: OSW 4.5,3.5
L70 = smd 1.8 x 0.8: 1 -4.85,4.4; 2 -4.85,3.3; 3 -4.85,2.2; 4 -4.85,1.1; 5 -4.85,0; 6 -4.85,-1.1; 7 -4.85,-2.2; 8 -4.85,-3.3; 9 -4.85,-4.4; 10 4.85,-4.4; 11 4.85,-3.3; 12 4.85,-2.2; 13 4.85,-1.1; 14 4.85,0; 15 4.85,1.1; 16 4.85,2.2; 17 4.85,3.3; 18 4.85,4.4
MSOP8 = smd 0.4 x 1.1: 1 -0.975,-2.25; 2 -0.325,-2.25; 3 0.325,-2.25; 4 0.975,-2.25; 5 0.975,2.25; 6 0.325,2.25; 7 -0.325,2.25; 8 -0.975,2.25
DFN10-3X3 = smd 0.25 x 0.45: 1 -1,-1.35; 2 -0.5,-1.35; 3 0,-1.35; 4 0.5,-1.35; 5 1,-1.35; 6 1,1.35; 7 0.5,1.35; 8 0,1.35; 9 -0.5,1.35; 10 -1,1.35 | smd 2.38 x 1.65: EXP 0,0
SOT23-5 = smd 0.6 x 0.9: 1 -0.95,-1.15; 2 0,-1.15; 3 0.95,-1.15; 4 0.95,1.15; 5 -0.95,1.15
SOT23-6 = smd 0.6 x 0.9: 1 -0.95,-1.15; 2 0,-1.15; 3 0.95,-1.15; 4 0.95,1.15; 5 0,1.15; 6 -0.95,1.15
LQFP64 = smd 0.3 x 1.6: 1 -3.75,-5.7; 2 -3.25,-5.7; 3 -2.75,-5.7; 4 -2.25,-5.7; 5 -1.75,-5.7; 6 -1.25,-5.7; 7 -0.75,-5.7; 8 -0.25,-5.7; 9 0.25,-5.7; 10 0.75,-5.7; 11 1.25,-5.7; 12 1.75,-5.7; 13 2.25,-5.7; 14 2.75,-5.7; 15 3.25,-5.7; 16 3.75,-5.7; 33 3.75,5.7; 34 3.25,5.7; 35 2.75,5.7; 36 2.25,5.7; 37 1.75,5.7; 38 1.25,5.7; 39 0.75,5.7; 40 0.25,5.7; 41 -0.25,5.7; 42 -0.75,5.7; 43 -1.25,5.7; 44 -1.75,5.7; 45 -2.25,5.7; 46 -2.75,5.7; 47 -3.25,5.7; 48 -3.75,5.7 | smd 1.6 x 0.3: 17 5.7,-3.75; 18 5.7,-3.25; 19 5.7,-2.75; 20 5.7,-2.25; 21 5.7,-1.75; 22 5.7,-1.25; 23 5.7,-0.75; 24 5.7,-0.25; 25 5.7,0.25; 26 5.7,0.75; 27 5.7,1.25; 28 5.7,1.75; 29 5.7,2.25; 30 5.7,2.75; 31 5.7,3.25; 32 5.7,3.75; 49 -5.7,3.75; 50 -5.7,3.25; 51 -5.7,2.75; 52 -5.7,2.25; 53 -5.7,1.75; 54 -5.7,1.25; 55 -5.7,0.75; 56 -5.7,0.25; 57 -5.7,-0.25; 58 -5.7,-0.75; 59 -5.7,-1.25; 60 -5.7,-1.75; 61 -5.7,-2.25; 62 -5.7,-2.75; 63 -5.7,-3.25; 64 -5.7,-3.75
SO-08M = smd 0.6 x 2.2: 1 -1.905,-3.33; 2 -0.635,-3.33; 3 0.635,-3.33; 4 1.905,-3.33; 5 1.905,3.33; 6 0.635,3.33; 7 -0.635,3.33; 8 -1.905,3.33
QFN32 = smd 0.8 x 0.25: 1 -2.5,1.75; 2 -2.5,1.25; 3 -2.5,0.75; 4 -2.5,0.25; 5 -2.5,-0.25; 6 -2.5,-0.75; 7 -2.5,-1.25; 8 -2.5,-1.75; 17 2.5,-1.75; 18 2.5,-1.25; 19 2.5,-0.75; 20 2.5,-0.25; 21 2.5,0.25; 22 2.5,0.75; 23 2.5,1.25; 24 2.5,1.75 | smd 0.25 x 0.8: 9 -1.75,-2.5; 10 -1.25,-2.5; 11 -0.75,-2.5; 12 -0.25,-2.5; 13 0.25,-2.5; 14 0.75,-2.5; 15 1.25,-2.5; 16 1.75,-2.5; 25 1.75,2.5; 26 1.25,2.5; 27 0.75,2.5; 28 0.25,2.5; 29 -0.25,2.5; 30 -0.75,2.5; 31 -1.25,2.5; 32 -1.75,2.5 | smd 3.5 x 3.5: EP 0,0
SOT25 = smd 0.55 x 1.2: 1 -0.95,-1.3; 2 0,-1.3; 3 0.95,-1.3; 4 0.95,1.3; 5 -0.95,1.3
JST-2-PTH = drill 0.7 pad 1.448: 1 -1,0; 2 1,0
JP2 = drill 0.914 long: 1 -2.54,0; 2 0,0; 3 2.54,0
JP1 = drill 0.914 long: 1 0,-1.27; 2 0,1.27
L2012C = smd 1 x 1: 1 -1,0; 2 1,0
L3225M = smd 1.6 x 2.2: 1 -1.4,0; 2 1.4,0
EADOGS-SOCKET = drill 0.61 pad 1.27: 1 -16.51,-38.1; 2 -13.97,-38.1; 13 13.97,-38.1; 14 16.51,-38.1; 15 16.51,0; 16 13.97,0; 17 11.43,0; 18 8.89,0; 19 6.35,0; 20 3.81,0; 21 1.27,0; 22 -1.27,0; 23 -3.81,0; 24 -6.35,0; 25 -8.89,0; 26 -11.43,0; 27 -13.97,0 | drill 0.6 pad 1.27: 28 -16.51,0
CHIP-LED0603 = smd 0.8 x 0.8: A 0,-0.75; C 0,0.75
WM-62PC/62PK = drill 0.6 pad 1: 1 -1,0.95; 2 -1,-0.95
JACK_35_4POLE = drill 1.5: 1 14.7,0; 2 14,2.8; 3 14,-2.8; 4@1 6,2.9; 4@2 6,-2.9 | hole 1.1: 4.5,0; 11.5,0
MICRO-SD-SOCKET-PP = smd 0.8 x 1.5: 1 -8.94,10.7; 2 -7.84,10.3; 3 -6.74,10.7; 4 -5.64,10.9; 5 -4.54,10.7; 6 -3.44,10.9; 7 -2.34,10.7; 8 -1.24,10.7 | smd 1.8 x 1.4: CD1 -2.05,0.4; CD2 -7.75,0.4 | smd 1.4 x 1.9: GND1 -13.6,14.55; GND3 -0.45,13.55
R0603 = smd 1 x 1.1: 1 -0.85,0; 2 0.85,0
CT/CN0805 = smd 1.2 x 1.4: 1 -1.1,0; 2 1.1,0
R0805 = smd 1.3 x 1.5: 1 -0.95,0; 2 0.95,0
MODULE_16X16_16PIN = drill 0.8 offset: 1 7,6.8; 2 5,6.8; 3 3,6.8; 4 1,6.8; 5 -1,6.8; 6 -3,6.8; 7 -5,6.8; 8 -7,6.8; 9 -7,-6.8; 10 -5,-6.8; 11 -3,-6.8; 12 -1,-6.8; 13 1,-6.8; 14 3,-6.8; 15 5,-6.8; 16 7,-6.8
MODULE_20X12_16PIN = drill 0.8 offset: 1 7,8.8; 2 5,8.8; 3 3,8.8; 4 1,8.8; 5 -1,8.8; 6 -3,8.8; 7 -5,8.8; 8 -7,8.8; 9 -7,-8.8; 10 -5,-8.8; 11 -3,-8.8; 12 -1,-8.8; 13 1,-8.8; 14 3,-8.8; 15 5,-8.8; 16 7,-8.8
B3F-10XX = drill 1.016 long: 1 -3.251,2.261; 2 3.251,2.261; 3 -3.251,-2.261; 4 3.251,-2.261
XTAL_7M = smd 1.4 x 1.2: 1 -1.1,-0.85; 2 1.1,-0.85; 3 1.1,0.85; 4 -1.1,0.85
BU-SMA-V = drill 1.27: 1 0,0 | drill 1.778: 2 -2.55,2.55; 3 2.55,2.55; 4 2.55,-2.55; 5 -2.55,-2.55
USB-MICROB = smd 0.35 x 1.4: D+ 0,2.65; D- -0.65,2.65; GND 1.3,2.65; ID 0.65,2.65; VBUS -1.3,2.65 | smd 1.8 x 1.9: MT1 -4,0; MT2 4,0
TC26H = drill 0.813 pad 1.676: 1 -1.27,0; 2 1.27,0

### Placement (x,y rotation side)
C1  20.2,22.6 270 top
C2  17.8,23 270 top
C3  79.8,38 270 top
C4  80.8,42 180 top
C5  23.8,10.4 180 top
C6  27.2,10.2 0 top
C7  64,39.8 90 top
C8  63.8,32.6 270 top
C9  65.8,33.8 270 top
C10  60.4,39.6 270 top
C11  75.6,35.2 270 top
C12  70,36.6 90 top
C13  70,39.6 90 top
C14  72.6,34.2 0 top
C15  77.8,36.2 90 top
C16  76,22.2 180 top
C17  76.2,24.6 180 top
C18  88.4,41.8 90 top
C19  86,37 270 top
C20  88.4,37 270 top
C21  93.8,38.6 270 top
C22  40.8,44 90 top
C23  42.6,44.2 90 top
C24  94.6,48 90 top
C25  91,48 270 top
C26  75.6,14.8 0 top
C27  75,18.2 0 top
C28  73,21.6 90 top
C29  75.4,16.6 0 top
C30  69.6,23 0 top
C31  69.6,21.2 0 top
C32  76,10.2 0 top
C33  72.8,10.8 270 top
C34  66,21.6 90 top
C35  64,20.6 90 top
C36  63,23.2 0 top
C37  59.2,20 90 top
C38  60.8,16.8 180 top
C39  64,17.4 90 top
C40  81,16.6 0 top
C41  80.4,14.4 0 top
C42  73.2,7 270 top
C43  74.8,7 270 top
C44  39.2,30 0 top
C45  39.2,34 0 top
C46  35.8,24.4 0 top
C47  35.8,30 180 top
C48  50,14.4 270 top
C49  36.8,20 180 top
C50  36.8,21.6 180 top
C51  47.2,14.6 270 top
C52  45.6,14.6 270 top
C53  41.6,35.6 180 top
C54  52.4,14.6 270 top
C55  38.2,24.8 270 top
C56  19.2,28 0 top
C57  21.6,29 0 top
C58  58.2,28.2 0 top
D1  81,19.4 270 top
D2  86.2,23.6 90 top
D3  95.2,10.6 0 top
D4  89.4,44.4 0 top
DC_IN  95,29.6 90 top
IC1  15.6,5.8 180 top
IC2  82.4,36.4 0 top
IC3  62.6,36 90 top
IC4  72.6,36.8 90 top
IC5  79.2,25.2 0 top
IC6  90.6,41.6 0 top
IC7  48,24.2 270 top
IC8  37,40.4 0 top
IC9  69,15.6 0 top
IC10  61.6,20 180 top
JP1  79,6.2 180 top
JP2  74.8,40 180 top
JP3  72.4,29 90 top
JP4  73.8,43.8 0 top
JP5  80.6,43.8 0 top
JP6  61.6,43.8 0 top
JP7  77,31.6 90 top
JP8  83.6,27.2 270 top
JP9  82.4,31.6 270 top
L1  6.8,8.2 270 top
L2  66,37.8 270 top
L3  86.2,41.8 270 top
L4  92.8,48 270 top
L5  75.4,12 180 top
L6  36.8,18.2 0 top
LCD1  52.4,9.2 180 top
LED1  1.2,8.2 180 top
LED2  83.6,22 90 top
LED3  40.8,47.8 180 top
LED4  3,33.2 90 top
LED5  3.2,31.4 90 top
LED6  2.4,19.4 90 top
LED7  2.4,20.8 90 top
M1  84.4,10.4 180 top
MIC  102.4,16.8 180 top
MICROSD  57.6,34.2 0 top
Q1  41.6,40.2 0 top
Q2  18.2,17.6 180 top
Q3  25.8,7 270 top
Q4  17.4,25.8 0 top
R1  7.8,5.8 0 top
R2  19.6,15.4 180 top
R3  64,11.4 0 top
R4  22.8,7 270 top
R5  4.8,8.2 270 top
R6  2.8,8.2 270 top
R7  79.8,34.8 90 top
R8  80.8,40.4 0 top
R9  85.6,45.6 180 top
R10  61.6,33.4 0 top
R11  61.6,31.8 180 top
R12  62.2,39.6 270 top
R13  68.6,36.6 270 top
R14  68.6,39.6 270 top
R15  79,29.4 180 top
R16  80.6,22 180 top
R17  82.2,24.2 90 top
R18  83.8,24.2 90 top
R19  82.2,29.4 180 top
R20  91,38.6 180 top
R21  91,37 0 top
R22  41.6,37.4 0 top
R23  42.2,47.6 270 top
R24  6.2,33.2 0 top
R25  6.2,31.4 0 top
R26  6.2,19.4 0 top
R27  6.2,21 0 top
R28  57.4,31.6 90 top
R29  59,31.6 90 top
R30  74.8,3.8 270 top
R31  73.2,3.8 270 top
R32  47.2,32.8 180 top
R33  20.2,25.6 0 top
RFM22B_23B_26W  17.6,38.2 90 top
RFM22B_23B_26W1  17.6,19.4 90 top
RFM69W_69HW  22.8,40.2 90 top
RFM69W_69HW1  22.8,21.4 90 top
S1  37.2,4 180 top
S2  47.2,4 180 top
S3  57.2,4 180 top
S4  67.2,4 180 top
U$1  35.8,27.2 270 top
X1  4.8,38.2 180 top
X2  4.8,26.4 0 top
X3  4.8,14.4 0 top
X4  98.4,43.8 90 top
X5  98.6,5.6 90 top
Y1  42,32 90 top

### Tracks (layer width: path | path; a pad name or v marks a point on that pad's centre or on a via)
+3V3  (33 unrouted)
  Top 0.2: IC9.21 72.85,15.85 73.2,16.2 74.15,16.2 C29.1 74.55,15.15 C26.1 | C27.1 72.15,18 IC9.24 | IC9.28 69.25,18.75 69,19 69,20.35 C31.1 | IC9.2 65.55,16.85 65.2,17.2 65.2,18.6 64.4,19.4 64.35,19.4 C35.1 | IC7.64 44.25,33.8 C53.1 | IC7.19 45.25,15.8 C52.1 C51.1 | IC7.32 51.75,16.85 52,16.6 52,15.85 C54.1 | IC7.48 57.1,27.95 C58.1
  Top 0.406: L5.1 76.4,12.2 75.6,13 74.8,13 74.2,13.6 C26.1 | C35.1 65.55,19.75 C34.1 66.6,20.8 66.6,21.2 68.2,22.8 C30.1 | IC10.1 62.55,22.7 C36.1 | IC10.3 60.65,22.05 61.2,22.6 61.45,22.6 C36.1 | C36.1 62.05,23.45 63.2,24.6 66.8,24.6 67.8,23.6 67.8,23.4 C30.1 | C31.1 68.75,22.45 C30.1 | C28.1 73,19.35 C27.1
BTN1  (2 unrouted)
  Top 0.2: IC7.17 44.25,16.95 44.6,16.6 44.6,13.6
BTN2  (2 unrouted)
  Top 0.2: IC7.16 42.3,18.3 44.2,16.4 44.2,13.8
BTN3  (2 unrouted)
  Top 0.2: IC7.15 41.15,20.95 40.8,20.6 40.8,19.2 43.8,16.2 43.8,14
BTN4  (1 unrouted)
  Top 0.2: S4.3 S4.4 63.95,7.35 65.2,8.6 65.2,11.05 R3.2 | IC7.14 40.85,21.45 40.4,21 40.4,19 43.4,16 43.4,13.8
CHG_CHG
  Top 0.2: IC5.3 79.2,22.55 R16.2
DC_IN
  Top 0.406: IC6.5 IC6.4 92.95,42.75 C21.1
GND  (via drill 0.3, 0.6)
  Top 0.2: IC3.4 63.1,36.5 IC3.EXP | IC3.9 62.3,35.5 v62.6,35.4 | IC9.20 69.85,15.35 69.8,15.4 69.2,15.4 IC9.EP | IC9.29 68.75,15.85 IC9.EP | IC9.18 70.25,14.35 IC9.EP
  other vias: 78.4,42.4 89.2,45.8 84.2,38.8 86.6,47 83.4,40 84.2,37.2 81.4,37.2 78.6,38.2 78.6,33.8 82.6,33 81.8,46.2 65.6,40.2 65.4,41.8 63.8,42 62,41.6 59.6,37.4 60.2,35.2 62.6,36.6 60.2,30.6 62,30.6 63.8,30.6 65.4,31.4 66.6,31.4 67.2,35.4 67.4,37.6 72.6,35.8 72.6,37.8 71.4,36.8 71.2,41.8 68.2,41.8 69,33.4 58.8,43.2 64.2,44.6 57.6,45.6 63.4,47 70.2,44.6 73.6,47.2 71.8,49.2 82.2,49.2 89.2,49.2 92,44.2 94.4,42.2 94.2,45 95.8,46 98,47.4 96,49.2 96,48 89.8,48 91.6,47.2 94,48.8 98.8,48.2 98,39.4 98.8,40.2 98,41.6 98.8,43 98,44.6 98.8,46 71.6,18.4 67.8,16.8 70.2,16.8 67.8,14.4 70.2,14.4 69,15.6 72.2,13.2 71,12 67.6,11.2 66.4,18.4 72.8,9.6 72,10.2 60.4,16.6 58.6,16.8 59.4,17.8 60.6,20 62.6,20 64,18.6 64,22.2 66,22.2 64,23.8 66,23.8 71.4,21.6 69.8,23 71,24 73,24 58.6,20.8 59.8,22.4 73.8,13 76,10.8 77.6,12 76,9 80,9.6 77.8,7.6 69.8,20 67.6,21 75.8,18.8 76.6,18.2 77.2,16.6 81.8,8.6 80.8,12.2 86.2,13 85.2,14.4 87,18.4 89.4,18 76.6,6.2 53.8,43.6 54.2,46.6 52.4,31.8 56.2,42.8 55.6,34.6 49.8,34.6 57.2,47.8 44,48.6 56.2,36.2 50.6,41.6 52.4,47.2 46.6,46.6 44,44.4 44,45.8 40.8,45.6 40,44.8 41.8,45 43,41.4 47.6,44.8 38.8,28.2 39.4,25 33.6,25.4 33.6,27.4 35.4,31.4 40.8,32 38.4,32 40,22.8 47.2,31.4 48,34.2 45.2,31.6 34.8,22.4 51.2,16.4 46,16.8 49.6,16.8 45.2,12.6 47.2,12.6 50,12.2 52.4,12.6 55.6,27.2
  pour Bottom (rank 2): 0,0 100,0 100,50 0,50
  pour Top (rank 2): 0,0 100,0 100,50 0,50
GPS_PWR  (1 unrouted)
I2S2_CK
  Top 0.2: IC9.7 65.55,14.35 65.4,14.2 57.8,14.2 56.8,15.2 56.8,18.8 55.8,19.8 52.8,19.8 52.4,20.2 52.4,20.8 52.55,20.95 IC7.34
I2S2_LRCK
  Top 0.2: IC9.6 65.45,14.85 65.2,14.6 58,14.6 57.2,15.4 57.2,19 55.75,20.45 IC7.33
I2S2_MCLK
  Top 0.2: IC7.37 52.45,22.45 52,22 52,20 52.6,19.4 55.6,19.4 56.4,18.6 56.4,15 57.6,13.8 65.6,13.8 65.65,13.85 IC9.8
I2S2_SDI  (via drill 0.3)
  Top 0.2: IC9.4 65.25,15.85 64.8,15.4 58.4,15.4 58,15.8 58,19.6 v57.8,19.8 | IC7.35 55.35,21.45 56.4,20.4 v56.6,20.4
  Bottom 0.2: v56.6,20.4 57.2,20.4 v57.8,19.8
I2S2_SDO
  Top 0.2: IC9.5 65.35,15.35 65,15 58.2,15 57.6,15.6 57.6,19.2 57.2,19.6 57.2,20.6 56.8,21 56.4,21 55.45,21.95 IC7.36
N$1
  Top 0.813: RFM69W_69HW1.2 RFM22B_23B_26W1.1 X2.1
N$2
  Top 0.813: RFM69W_69HW.2 RFM22B_23B_26W.1 X1.1
N$3  (1 unrouted)
N$4  (3 unrouted)
N$5  (1 unrouted)
N$6  (3 unrouted)
N$7  (1 unrouted)
N$8
  Top 0.406: IC1.8 23.35,9.1 C5.1 26.05,10.4 C6.1 26.6,9.85 26.6,7.6 26.9,7.3 Q3.3
N$9  (1 unrouted)
  pour Top (no thermals): 63.8,37 63.8,37.4 63.4,37.8 61.8,37.8 61.4,37.4 61.4,36 60.4,36 60.4,37.2 61.4,38.2 61.4,39 61.8,39.4 66.4,39.4 66.6,39.2 66.6,38 66.4,37.8 65.2,37.8 64.4,37
N$10
  Top 0.61: JP2.3 72.26,43.26 JP4.1
N$11
  Top 0.2: IC2.6 82.72,42.88 R9.2
  Top 0.61: JP5.1 79.6,44.2 80.6,45.2 82.2,45.2 83.2,44.2 83.4,44.25 R9.2
N$12
  Top 0.2: IC5.9 78.7,27.9 78.2,28.4 78.2,29.35 R15.2 78.15,31.48 JP7.1
N$13  (2 unrouted)
  Top 0.2: IC5.6 80.2,27.2 80.4,27.4
N$14
  pour Top (no thermals): 68,36.2 71.8,36.2 72,36 72,35.2 72.4,34.8 72.4,33.2 73.2,32.4 73.4,32.4 74,31.8 74,31.2 73.4,30.6 71.4,30.6 70.8,31.2 70.8,34.6 70.2,35.2 68.2,35.2 68,35.4
N$15
  Top 0.2: R8.1 79.95,39 C3.1 81.22,38.85 IC2.8
N$16
  Top 0.2: C8.1 63.8,34.85 IC3.1
N$17
  Top 0.2: IC2.2 82.08,35.12 81.6,35.6 79.85,35.6 R7.2
N$18
  Top 0.2: R10.2 62.45,33.35 63.2,32.6 64.4,32.6 64.6,32.8 64.6,34 64.8,34.2 | IC3.2 64.7,35.5 65,35.2
  Top 0.61: JP3.1 71.74,26.46 70.4,27.8 70.4,30.6 70,31 70,34 69.6,34.4 66.15,34.4 C9.1
  pour Top (no thermals): 64.6,35.6 66.4,35.6 66.6,35.4 66.6,34.2 66.4,34 64.6,34
N$19
  Top 0.2: IC3.3 64.6,36
  pour Top (no thermals): 64.4,36 64.4,36.4 65.2,37.2 66.4,37.2 66.6,37 66.6,36.2 66.4,36
N$20
  pour Top (no thermals): 71.8,37.6 71.8,38 71,38 70.6,38.4 70.6,39.2 70.4,39.4 68.2,39.4 68,39.2 68,37 68.2,36.8 70.4,36.8 70.6,37 71.2,37.6
N$21
  Top 0.2: IC3.10 61.25,33.9 R10.1 R11.2
N$22  (1 unrouted)
N$23  (1 unrouted)
N$24  (1 unrouted)
N$25
  Top 0.2: IC5.7 79.7,27.5 80.6,28.4 81.2,28.4 81.4,28.6 81.4,29.35 R19.2 81.35,31.38 JP9.1
N$26  (1 unrouted)
N$27  (3 unrouted)
N$28  (2 unrouted)
N$29
  Top 0.61: MICROSD.4 51.96,46.04 51.6,46.4 48,46.4 45,43.4 42.65,43.4 C23.1 41.1,43.35 C22.1 40.8,42.1 Q1.3
N$30  (1 unrouted)
N$31  (1 unrouted)
N$32  (1 unrouted)
N$33  (1 unrouted)
N$34  (1 unrouted)
N$35  (1 unrouted)
  Top 0.2: X4.D+ 94,43.8 91.6,46.2 90.4,46.2 88.4,48.2 72.8,48.2 70.4,45.8 59.6,45.8 57.4,43.6 57.4,34.4
N$36  (1 unrouted)
  Top 0.2: X4.D- 94.05,43.15 91.4,45.8 90.2,45.8 88.2,47.8 73,47.8 70.6,45.4 59.8,45.4 57.8,43.4 57.8,34.4
N$37
  Top 0.406: X4.VBUS 96.7,42.5 97,42.8 97,46.4 96.4,47 94.75,47 C24.1 94.45,47 L4.2
N$38
  Top 0.2: IC9.14 69.75,12.25 71.2,10.8 71.2,9.6 72,8.8 73.85,8.8 C43.1
N$39
  Top 0.2: IC9.17 71.5,12.95 C33.1
  Top 0.406: C33.1 72.8,11.6 73.4,11 73.8,11 C32.1 74.4,10.4 L5.2
N$40
  Top 0.2: IC10.4 59.65,18.7 C37.1
N$41
  Top 0.406: MIC.4@1 MIC.4@2 90.9,19.7 89.4,21.2 87.6,21.2 83.4,17 82.8,17 C40.2
N$42
  Top 0.406: MIC.3 86.8,19.6 83.6,16.4 83.6,15.4 83.2,15 82.4,15 C41.2
N$43  (via drill 0.3)
  Top 0.2: IC9.30 68.25,19.15 v68.4,19.4
  Top 0.406: v75.2,19.6 76.8,19.6 77.6,18.8 77.6,17.4 78.4,16.6 78.4,15 C41.1
  Bottom 0.406: v68.4,19.4 68.4,19.8 69.4,20.8 72.2,20.8 72.4,20.6 74.8,20.6 75.2,20.2 v75.2,19.6
N$44  (via drill 0.3)
  Top 0.2: IC9.27 69.75,18.95 70.8,20 v71.6,20
  Top 0.406: v74.4,19.8 75,20.4 75.6,20.4 75.8,20.2 77,20.2 78.2,19 78.2,17.6 78.8,17 79.2,17 C40.1
  Bottom 0.406: v71.6,20 73.8,20 74,19.8 v74.4,19.8
N$45
  Top 0.2: Y1.1 40.78,30.73 C44.2 40,29.95 40,27.2 40.75,26.45 IC7.4
N$46
  Top 0.2: C42.1 73.15,7.8 72.4,7.8 70.8,9.4 70.8,10.6 69.25,12.15 IC9.13
N$47  (via drill 0.3)
  Top 0.2: R31.1 C42.2 | C42.2 73.55,6.15 v73.6,6.2 | C42.2 72.75,6.6 72.4,6.6 70,9 70,10.2 68.25,11.95 IC9.11 | v76.2,8.2 76.6,8.2 77.2,8.8 80.8,8.8 86,14 86,15.1 MIC.1
  Bottom 0.2: v73.6,6.2 74.2,6.2 v76.2,8.2
N$48  (via drill 0.3)
  Top 0.2: R30.1 C43.2 75.15,6.15 v75.2,6.2 | v76.8,7.6 76.8,7.8 77.4,8.4 81,8.4 82.2,9.6 85.25,9.6 M1.1
  Bottom 0.2: v75.2,6.2 75.2,6.6 76,7.4 76.6,7.4 v76.8,7.6
N$49
  Top 0.2: R31.2 R30.2 75.8,3.95 75.8,6.6 75.4,7 72.6,7 70.4,9.2 70.4,10.4 68.75,12.05 IC9.12
N$50  (via drill 0.3)
  Top 0.2: v73.4,16.8 73,16.8 72.6,16.4 71.55,16.4 IC9.22 | IC9.26 70.25,18.65 v70.8,19.2
  Bottom 0.61: v70.8,19.2 72,19.2 73.4,17.8 v73.4,16.8 73.4,15.6 73.6,15.4 73.6,14.4 77,11 77.2,11 81.4,6.8 81.4,5.6 80.6,4.8 79.4,4.8 JP1.2
N$51  (via drill 0.3)
  Top 0.2: IC9.23 72.25,16.85 v72.6,17.2 | v72.8,15 71.55,14.8 IC9.19
  Bottom 0.61: v72.6,17.2 72.6,15.2 v72.8,15 72.8,13.8 73,13.6 73,12.6 75.6,10 77,10 80,7 JP1.1
N$52
  Top 0.2: C45.2 40.78,33.27 Y1.2 43.2,32.07 43.2,30.2 42.4,29.4 41.2,29.4 40.4,28.6 40.4,27.4 40.85,26.95 IC7.3
N$53
  Top 0.2: IC7.7 40.45,24.95 39.6,25.8 38.35,25.8 C55.1
N$54
  Top 0.2: IC7.5 40.65,25.95 39.4,27.2 35.8,27.2 35.2,27.8 35.2,28.05 U$1.1 C47.2
N$55
  Top 0.2: IC7.6 40.55,25.45 39.4,26.6 37.15,26.6 U$1.3 C46.2
N$56  (3 unrouted)
N$57
  Top 0.2: IC7.60 46.25,32.7 R32.2
N$58
  Top 0.2: IC7.30 50.75,16.95 50.6,16.8 50.6,15.95 C48.1
N$59
  Top 0.2: IC7.13 38,21.95 C50.1 C49.1 37.6,20 L6.1
R1_DIO0
  Top 0.2: RFM69W_69HW.10 28.4,35.2 25.4,32.2 23.4,32.2 21.4,34.2 11.8,34.2 RFM22B_23B_26W.6 9,35.2 8.4,35.8 8.4,38.4 9.2,39.2 RFM22B_23B_26W.4
R1_DIO1  (via drill 0.3)
  Top 0.2: RFM22B_23B_26W.7 11.8,32.2 21.4,32.2 23.4,30.2 v26.6,30.2 | RFM69W_69HW.11 33,37.2 34,36.2 34,33.2 32.8,32 v27.6,32
  Bottom 0.2: v27.6,32 27.6,31.2 v26.6,30.2
R1_DIO2
  Top 0.2: RFM22B_23B_26W.8 9.4,31.2 7.8,32.8 7.8,39.4 9.6,41.2 RFM22B_23B_26W.3 11.8,42.2 20.4,42.2 22.4,44.2 33.8,44.2 34.2,43.8 34.2,40.6 32.8,39.2 RFM69W_69HW.12
R1_DIO3
  Top 0.2: RFM69W_69HW.13 30.2,39.8 30.2,38.8 30.8,38.2 33.6,38.2 34.4,36.4 34.4,32.6 33,31.4 24.6,31.4 RFM22B_23B_26W.9
R1_DIO4
  Top 0.2: RFM69W_69HW.14 29.8,43.2 27.8,41.2 RFM22B_23B_26W.14
R1_NSS
  Top 0.2: RFM69W_69HW.7 12.8,35.2 11.8,36.2 11.8,41.4 12.4,42 20.4,42 23,39.4 24.2,39.4 RFM22B_23B_26W.13
R1_PWR  (1 unrouted)
R1_RESET
  Top 0.2: RFM69W_69HW.9 32.6,33.2 33.6,34.2 33.6,35.8 33.4,36 30.6,36 26.4,40.2 24.2,40.2 23.4,41 23.4,42.2 RFM22B_23B_26W.15
R2_DIO0  (2 unrouted)
R2_DIO1  (1 unrouted)
R2_DIO2  (2 unrouted)
R2_DIO3  (1 unrouted)
R2_DIO4  (1 unrouted)
R2_NSS  (1 unrouted)
R2_PWR  (1 unrouted)
R2_RESET  (1 unrouted)
R12_MISO  (2 unrouted)
  Top 0.2: RFM69W_69HW.5 19.6,39.2 22.6,36.2 26,36.2 26.8,35.4 26.8,34.8 25.4,33.4 24.6,33.4 RFM22B_23B_26W.10
R12_MOSI  (2 unrouted)
  Top 0.2: RFM69W_69HW.6 20.8,37.2 22.8,35.2 RFM22B_23B_26W.11
R12_SCK  (2 unrouted)
  Top 0.2: RFM22B_23B_26W.12 22.2,37.2 18.4,41 14.2,41 RFM69W_69HW.4
SCL  (1 unrouted)
  Top 0.2: IC9.10 67.75,12.35 67.6,12.2 66.2,12.2 65.4,13 57.2,13 55.6,14.6 55.6,16.8
SD_PWR  (1 unrouted)
SDA  (1 unrouted)
  Top 0.2: IC9.9 65.9,13.1 65.6,13.4 57.4,13.4 56,14.8 56,17
SDIO_CK
  Top 0.2: IC7.53 49.75,31.55 52,33.8 52,43.8 52.2,44 52.6,44 52.8,44.2 52.8,44.64 MICROSD.5 53,44.84
SDIO_CMD
  Top 0.2: IC7.54 49.25,31.65 51.6,34 51.6,43.8 51,44.4 51,44.76 MICROSD.3
SDIO_D0  (via drill 0.3)
  Top 0.2: IC7.56 48.25,31.25 49.6,32.6 v49.6,33 | v53.4,33.4 53.4,33.8 53.2,34 53.2,41.8 55.2,43.8 55.2,44.84 MICROSD.7
  Bottom 0.2: v49.6,33 53,33 v53.4,33.4
SDIO_D1
  Top 0.2: IC7.40 52.45,23.95 52,24.4 52,28.2 52.4,28.6 52.4,30.2 54,31.8 54,33.8 53.6,34.2 53.6,41.6 55.8,43.8 56,43.8 56.2,44 56.2,44.74 MICROSD.8
SDIO_D2  (via drill 0.3)
  Top 0.2: IC7.51 50.75,31.35 52.8,33.4 52.8,42.2 v53.2,42.6 | MICROSD.1 48.66,44.54 48.8,44.4 48.8,43.8 49.2,43.4 50.4,43.4 v51,42.8
  Bottom 0.2: v51,42.8 52.2,42.8 52.4,42.6 v53.2,42.6
SDIO_D3  (via drill 0.3)
  Top 0.2: IC7.52 50.25,31.45 52.4,33.6 52.4,42.8 52.6,43 v52.6,43.2 | MICROSD.2 49.76,44.24 50.2,43.8 50.8,43.8 v51,43.6
  Bottom 0.2: v52.6,43.2 51.4,43.2 v51,43.6
USB_DM  (1 unrouted)
USB_DP  (1 unrouted)
USB_VBUS1  (3 unrouted)
  Top 0.2: C25.1 89.85,48.85 89.6,48.6 72.6,48.6 70.2,46.2 59.4,46.2 57,43.8 57,33.6 56.4,33 56.4,32
VBAT15_U
  Top 0.2: C10.1 R12.1
VDD18
  Top 0.2: IC9.3 64.2,16.35 C39.1
  pour Top (no thermals): 61.4,15.8 64.6,15.8 64.8,16 64.8,16.8 64.6,17 63.4,17 63,17.4 63,19.2 62.2,19.2 62.2,18.4 61.4,17.6
VDD42
  pour Top (no thermals): 73.6,35.6 76.4,35.6 76.6,35.8 76.6,38 75.8,38.8 75.8,41 75.2,41.6 74.4,41.6 73.8,41 73.8,38.8 73.4,38.4 73.4,37.6 74.2,37.6 74.6,37.2 74.6,36.4 74.2,36 73.6,36
VDD45  (5 unrouted)
  Top 0.2: IC5.1 78.2,19.4 79.2,18.4 79.85,18.4 D1.2
VLIPO  (via drill 0.6)
  Top 0.2: JP5.2 81.6,42.05 C4.1 R8.2 82.08,39.98 IC2.7 | IC5.10 78.2,26.73 JP7.2 75.93,31.93 77.8,33.8 C15.1
  Top 0.61: v77.8,35.4 C15.1
  Bottom 0.61: JP5.2 81.6,42.6 79,40 JP2.1 77.34,35.86 v77.8,35.4
VUSB  (3 unrouted)
  Top 0.2: IC5.2 78.7,21.1 79.4,20.4 79.85,20.4 D1.1